# EAGLE design alu3 (EAGLE 7.6.0)
ALU

## Sheet 1 of 8: Accum Reg
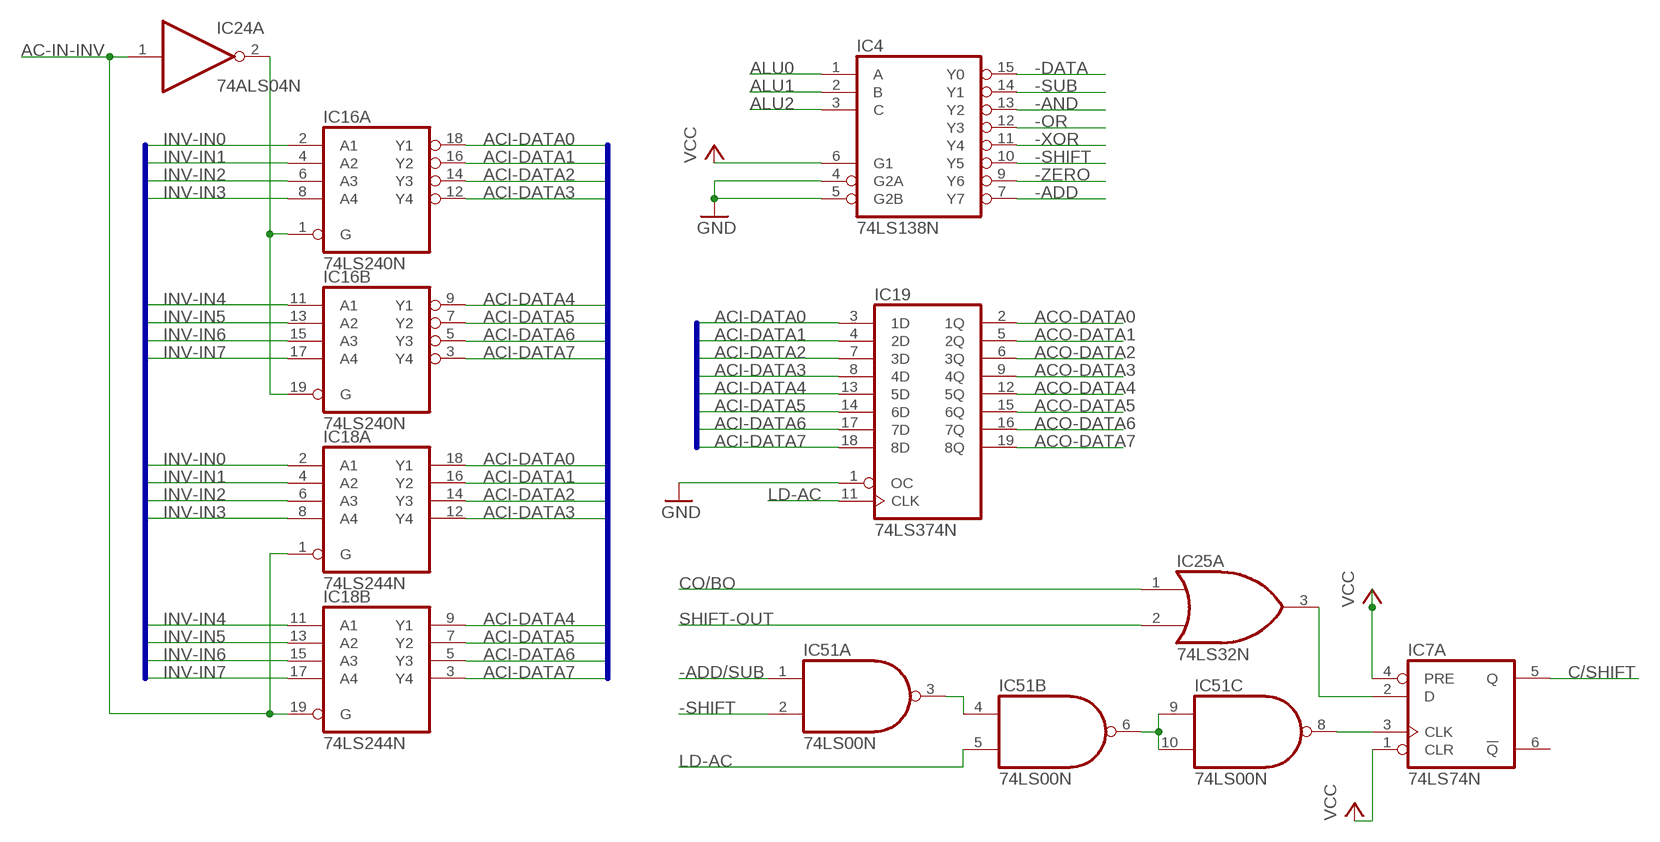
[diagram p0: schematic, sheet 1]

### Parts
IC4  74LS138N  [DIL16]
IC7  74LS74N  [DIL14]
IC16  74LS240N  [DIL20]
IC18  74LS244N  [DIL20]
IC19  74LS374N  [DIL20]
IC24  74ALS04N  [DIL14]
IC25  74LS32N  [DIL14]
IC51  74LS00N  [DIL14]

### Nets
-ADD: IC4.7(Y7) ; also sheet 8
-ADD/SUB: IC51.1(A:I0) ; also sheet 8
-AND: IC4.13(Y2) ; also sheet 5
-DATA: IC4.15(Y0) ; also sheet 4
-OR: IC4.12(Y3) ; also sheet 5
-SHIFT: IC4.10(Y5) IC51.2(A:I1) ; also sheet 7
-SUB: IC4.14(Y1) ; also sheet 8
-XOR: IC4.11(Y4) ; also sheet 5
-ZERO: IC4.9(Y6) ; also sheet 5
AC-IN-INV: IC18.1(A:G) IC18.19(B:G) IC24.1(A:I) ; also sheet 2,6
ACI-DATA0: IC16.18(A:Y1) IC18.18(A:Y1) IC19.3(1D)
ACI-DATA1: IC16.16(A:Y2) IC18.16(A:Y2) IC19.4(2D)
ACI-DATA2: IC16.14(A:Y3) IC18.14(A:Y3) IC19.7(3D)
ACI-DATA3: IC16.12(A:Y4) IC18.12(A:Y4) IC19.8(4D)
ACI-DATA4: IC16.9(B:Y1) IC18.9(B:Y1) IC19.13(5D)
ACI-DATA5: IC16.7(B:Y2) IC18.7(B:Y2) IC19.14(6D)
ACI-DATA6: IC16.5(B:Y3) IC18.5(B:Y3) IC19.17(7D)
ACI-DATA7: IC16.3(B:Y4) IC18.3(B:Y4) IC19.18(8D)
ACO-DATA0: IC19.2(1Q) ; also sheet 4,5,6,7,8
ACO-DATA1: IC19.5(2Q) ; also sheet 4,5,6,7,8
ACO-DATA2: IC19.6(3Q) ; also sheet 4,5,6,7,8
ACO-DATA3: IC19.9(4Q) ; also sheet 4,5,6,7,8
ACO-DATA4: IC19.12(5Q) ; also sheet 4,5,6,7,8
ACO-DATA5: IC19.15(6Q) ; also sheet 4,5,6,7,8
ACO-DATA6: IC19.16(7Q) ; also sheet 4,5,6,7,8
ACO-DATA7: IC19.19(8Q) ; also sheet 4,5,6,7,8
ALU0: IC4.1(A) ; also sheet 2,6,7
ALU1: IC4.2(B) ; also sheet 2,6,7
ALU2: IC4.3(C) ; also sheet 2,6,7
C/SHIFT: IC7.5(A:Q) ; also sheet 6,7,8
CO/BO: IC25.1(A:I0) ; also sheet 8
GND: IC4.4(G2A) IC4.5(G2B) IC19.1(OC) ; also sheet 2,5,6,7
INV-IN0: IC16.2(A:A1) IC18.2(A:A1) ; also sheet 4,5,7,8
INV-IN1: IC16.4(A:A2) IC18.4(A:A2) ; also sheet 4,5,7,8
INV-IN2: IC16.6(A:A3) IC18.6(A:A3) ; also sheet 4,5,7,8
INV-IN3: IC16.8(A:A4) IC18.8(A:A4) ; also sheet 4,5,7,8
INV-IN4: IC16.11(B:A1) IC18.11(B:A1) ; also sheet 4,5,7,8
INV-IN5: IC16.13(B:A2) IC18.13(B:A2) ; also sheet 4,5,7,8
INV-IN6: IC16.15(B:A3) IC18.15(B:A3) ; also sheet 4,5,7,8
INV-IN7: IC16.17(B:A4) IC18.17(B:A4) ; also sheet 4,5,7,8
LD-AC: IC19.11(CLK) IC51.5(B:I1) ; also sheet 2
N$3: IC51.3(A:O) IC51.4(B:I0)
N$4: IC51.6(B:O) IC51.9(C:I0) IC51.10(C:I1)
N$5: IC7.3(A:CLK) IC51.8(C:O)
N$7: IC7.2(A:D) IC25.3(A:O)
N$42: IC16.1(A:G) IC16.19(B:G) IC24.2(A:O)
SHIFT-OUT: IC25.2(A:I1) ; also sheet 7
VCC: IC4.6(G1) IC7.1(A:CLR) IC7.4(A:PRE) ; also sheet 2,6,7
Unconnected: IC7.6(A:!Q) IC24.5(C:I) IC24.6(C:O) IC24.10(E:O) IC24.11(E:I) IC25.4(B:I0) IC25.5(B:I1) IC25.6(B:O) IC25.11(D:O) IC25.12(D:I0) IC25.13(D:I1) IC51.11(D:O) IC51.12(D:I0) IC51.13(D:I1)

### Buses
INV-IN[0..7]
ACI-DATA[0..7]

## Sheet 2 of 8: BUS
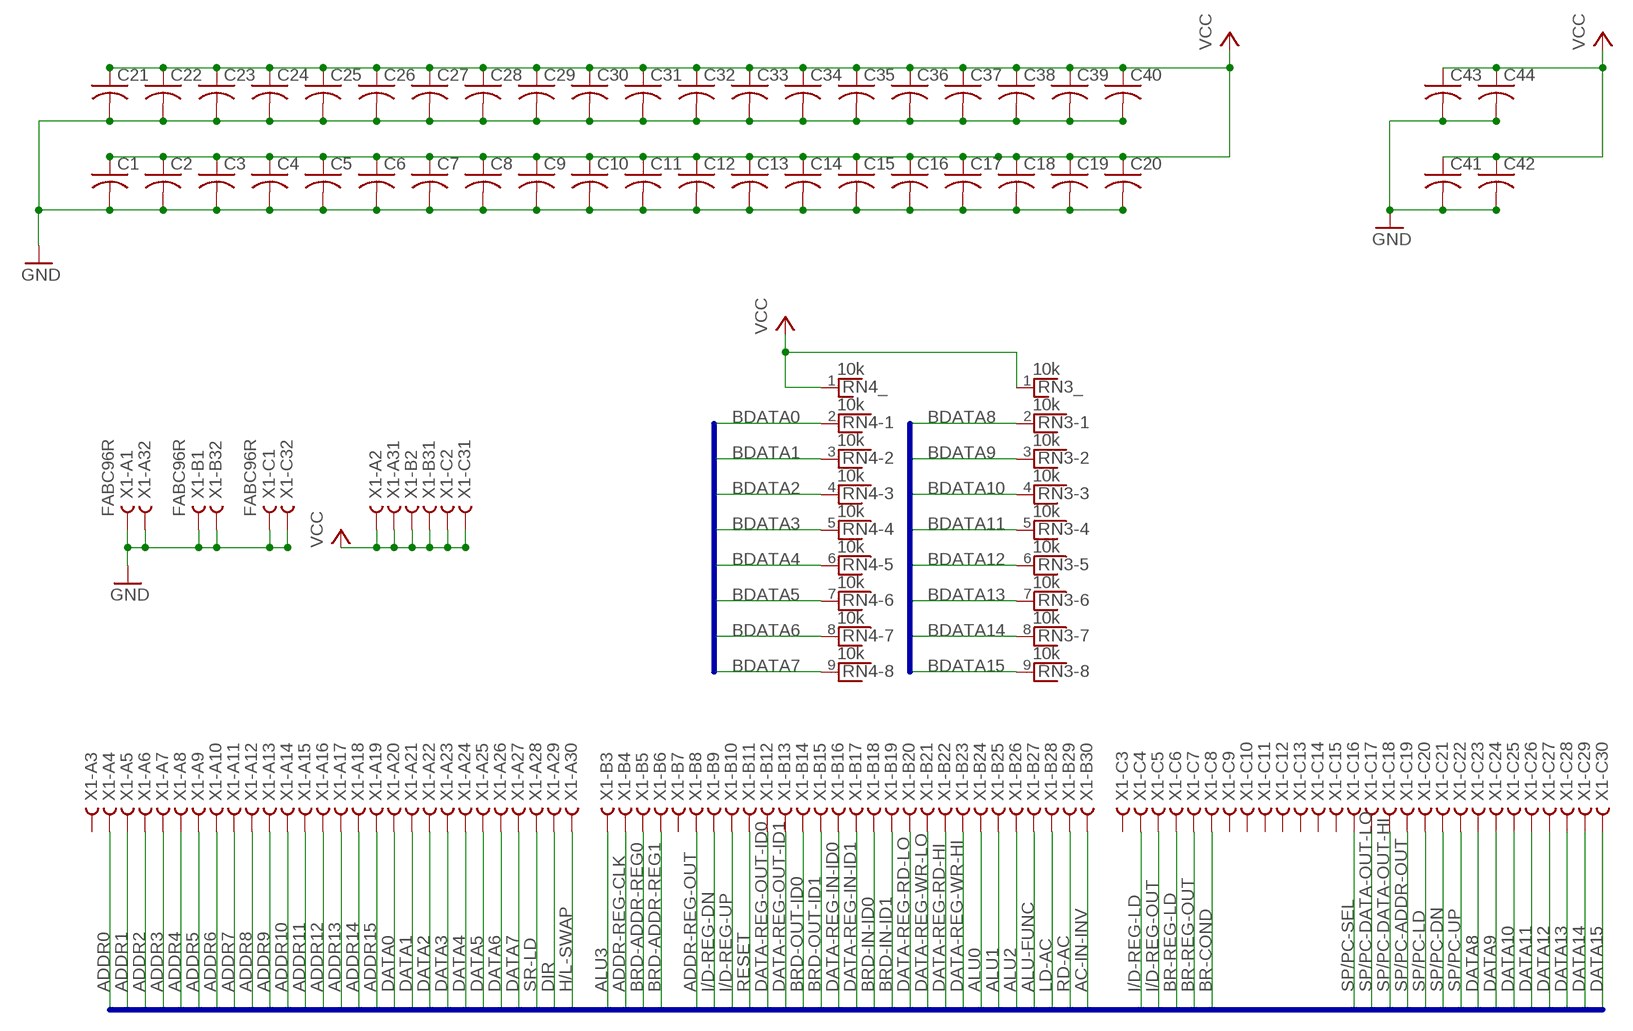
[diagram p1: schematic, sheet 2]

### Parts
C1  C-US025-024X044  [C025-024X044]
C2  C-US025-024X044  [C025-024X044]
C3  C-US025-024X044  [C025-024X044]
C4  C-US025-024X044  [C025-024X044]
C5  C-US025-024X044  [C025-024X044]
C6  C-US025-024X044  [C025-024X044]
C7  C-US025-024X044  [C025-024X044]
C8  C-US025-024X044  [C025-024X044]
C9  C-US025-024X044  [C025-024X044]
C10  C-US025-024X044  [C025-024X044]
C11  C-US025-024X044  [C025-024X044]
C12  C-US025-024X044  [C025-024X044]
C13  C-US025-024X044  [C025-024X044]
C14  C-US025-024X044  [C025-024X044]
C15  C-US025-024X044  [C025-024X044]
C16  C-US025-024X044  [C025-024X044]
C17  C-US025-024X044  [C025-024X044]
C18  C-US025-024X044  [C025-024X044]
C19  C-US025-024X044  [C025-024X044]
C20  C-US025-024X044  [C025-024X044]
C21  C-US025-024X044  [C025-024X044]
C22  C-US025-024X044  [C025-024X044]
C23  C-US025-024X044  [C025-024X044]
C24  C-US025-024X044  [C025-024X044]
C25  C-US025-024X044  [C025-024X044]
C26  C-US025-024X044  [C025-024X044]
C27  C-US025-024X044  [C025-024X044]
C28  C-US025-024X044  [C025-024X044]
C29  C-US025-024X044  [C025-024X044]
C30  C-US025-024X044  [C025-024X044]
C31  C-US025-024X044  [C025-024X044]
C32  C-US025-024X044  [C025-024X044]
C33  C-US025-024X044  [C025-024X044]
C34  C-US025-024X044  [C025-024X044]
C35  C-US025-024X044  [C025-024X044]
C36  C-US025-024X044  [C025-024X044]
C37  C-US025-024X044  [C025-024X044]
C38  C-US025-024X044  [C025-024X044]
C39  C-US025-024X044  [C025-024X044]
C40  C-US025-024X044  [C025-024X044]
C41  C-US025-024X044  [C025-024X044]
C42  C-US025-024X044  [C025-024X044]
C43  C-US025-024X044  [C025-024X044]
C44  C-US025-024X044  [C025-024X044]
RN3  10k  RNX8  [RN-9]
RN4  10k  RNX8  [RN-9]
X1  FABC96R  [FABC96R]

### Nets
AC-IN-INV: X1.B30 ; also sheet 1,6
ADDR0: X1.A4
ADDR1: X1.A5
ADDR2: X1.A6
ADDR3: X1.A7
ADDR4: X1.A8
ADDR5: X1.A9
ADDR6: X1.A10
ADDR7: X1.A11
ADDR8: X1.A12
ADDR9: X1.A13
ADDR10: X1.A14
ADDR11: X1.A15
ADDR12: X1.A16
ADDR13: X1.A17
ADDR14: X1.A18
ADDR15: X1.A19
ADDR-REG-CLK: X1.B4
ADDR-REG-OUT: X1.B8
ALU0: X1.B24 ; also sheet 1,6,7
ALU1: X1.B25 ; also sheet 1,6,7
ALU2: X1.B26 ; also sheet 1,6,7
ALU3: X1.B3 ; also sheet 7,8
ALU-FUNC: X1.B27 ; also sheet 4
BDATA0: RN4.2 ; also sheet 3,4,5,6,8
BDATA1: RN4.3 ; also sheet 3,4,5,6,8
BDATA2: RN4.4 ; also sheet 3,4,5,6,8
BDATA3: RN4.5 ; also sheet 3,4,5,6,8
BDATA4: RN4.6 ; also sheet 3,4,5,6,8
BDATA5: RN4.7 ; also sheet 3,4,5,6,8
BDATA6: RN4.8 ; also sheet 3,4,5,6,8
BDATA7: RN4.9 ; also sheet 3,4,5,6,8
BDATA8: RN3.2 ; also sheet 3,4,6
BDATA9: RN3.3 ; also sheet 3,4,6
BDATA10: RN3.4 ; also sheet 3,4,6
BDATA11: RN3.5 ; also sheet 3,4,6
BDATA12: RN3.6 ; also sheet 3,4,6
BDATA13: RN3.7 ; also sheet 3,4,6
BDATA14: RN3.8 ; also sheet 3,4,6
BDATA15: RN3.9 ; also sheet 3,4,6
BR-COND: X1.C8 ; also sheet 6
BR-REG-LD: X1.C6
BR-REG-OUT: X1.C7
BRD-ADDR-REG0: X1.B5
BRD-ADDR-REG1: X1.B6
BRD-IN-ID0: X1.B18
BRD-IN-ID1: X1.B19
BRD-OUT-ID0: X1.B14
BRD-OUT-ID1: X1.B15
DATA0: X1.A20 ; also sheet 4
DATA1: X1.A21 ; also sheet 4
DATA2: X1.A22 ; also sheet 4
DATA3: X1.A23 ; also sheet 4
DATA4: X1.A24 ; also sheet 4
DATA5: X1.A25 ; also sheet 4
DATA6: X1.A26 ; also sheet 4
DATA7: X1.A27 ; also sheet 4
DATA8: X1.C23 ; also sheet 4
DATA9: X1.C24 ; also sheet 4
DATA10: X1.C25 ; also sheet 4
DATA11: X1.C26 ; also sheet 4
DATA12: X1.C27 ; also sheet 4
DATA13: X1.C28 ; also sheet 4
DATA14: X1.C29 ; also sheet 4
DATA15: X1.C30 ; also sheet 4
DATA-REG-IN-ID0: X1.B16
DATA-REG-IN-ID1: X1.B17
DATA-REG-OUT-ID0: X1.B12
DATA-REG-OUT-ID1: X1.B13
DATA-REG-RD-HI: X1.B22
DATA-REG-RD-LO: X1.B20
DATA-REG-WR-HI: X1.B23
DATA-REG-WR-LO: X1.B21
DIR: X1.A29
GND: C1.2 C2.2 C3.2 C4.2 C5.2 C6.2 C7.2 C8.2 C9.2 C10.2 C11.2 C12.2 C13.2 C14.2 C15.2 C16.2 C17.2 C18.2 C19.2 C20.2 C21.2 C22.2 C23.2 C24.2 C25.2 C26.2 C27.2 C28.2 C29.2 C30.2 C31.2 C32.2 C33.2 C34.2 C35.2 C36.2 C37.2 C38.2 C39.2 C40.2 C41.2 C42.2 C43.2 C44.2 X1.A1 X1.A32 X1.B1 X1.B32 X1.C1 X1.C32 ; also sheet 1,5,6,7
H/L-SWAP: X1.A30
I/D-REG-DN: X1.B9 ; also sheet 3
I/D-REG-LD: X1.C4 ; also sheet 3
I/D-REG-OUT: X1.C5 ; also sheet 3,4
I/D-REG-UP: X1.B10 ; also sheet 3
LD-AC: X1.B28 ; also sheet 1
RD-AC: X1.B29 ; also sheet 4
RESET: X1.B11 ; also sheet 3
SP/PC-ADDR-OUT: X1.C19
SP/PC-DATA-OUT-HI: X1.C18
SP/PC-DATA-OUT-LO: X1.C17
SP/PC-DN: X1.C21
SP/PC-LD: X1.C20
SP/PC-SEL: X1.C16
SP/PC-UP: X1.C22
SR-LD: X1.A28 ; also sheet 7
VCC: C1.1 C2.1 C3.1 C4.1 C5.1 C6.1 C7.1 C8.1 C9.1 C10.1 C11.1 C12.1 C13.1 C14.1 C15.1 C16.1 C17.1 C18.1 C19.1 C20.1 C21.1 C22.1 C23.1 C24.1 C25.1 C26.1 C27.1 C28.1 C29.1 C30.1 C31.1 C32.1 C33.1 C34.1 C35.1 C36.1 C37.1 C38.1 C39.1 C40.1 C41.1 C42.1 C43.1 C44.1 RN3.1 RN4.1 X1.A2 X1.A31 X1.B2 X1.B31 X1.C2 X1.C31 ; also sheet 1,6,7
Unconnected: X1.A3 X1.B7 X1.C3 X1.C9 X1.C10 X1.C11 X1.C12 X1.C13 X1.C14 X1.C15

### Buses
ADDR[0..15],DATA[0..15],DIR,H/L-SWAP,ADDR-REG-CLK,BRD-ADDR-REG[0..1],ADDR-REG-OUT,I/D-REG-DN,I/D-REG-UP,RESET,DATA-REG-OUT-ID[0..1],BRD-OUT-ID[0..1],DATA-REG-IN-ID[0..1],BRD-IN-ID[0..1],DATA-REG-RD-LO,DATA-REG-WR-LO,DATA-REG-RD-HI,DATA-REG-WR-HI,ALU[0..3],ALU-FUNC,LD-AC,RD-AC,AC-IN-INV,I/D-REG-LD,I/D-REG-OUT,BR-REG-LD,BR-REG-OUT,BR-COND,SP/PC-SEL,SP/PC-DATA-OUT-LO,SP/PC-DATA-OUT-HI,SP/PC-ADDR-OUT,SP/PC-LD,SP/PC-DN,SP/PC-UP,SR-LD
BDATA[0..15]

## Sheet 3 of 8: Reg INC/DEC
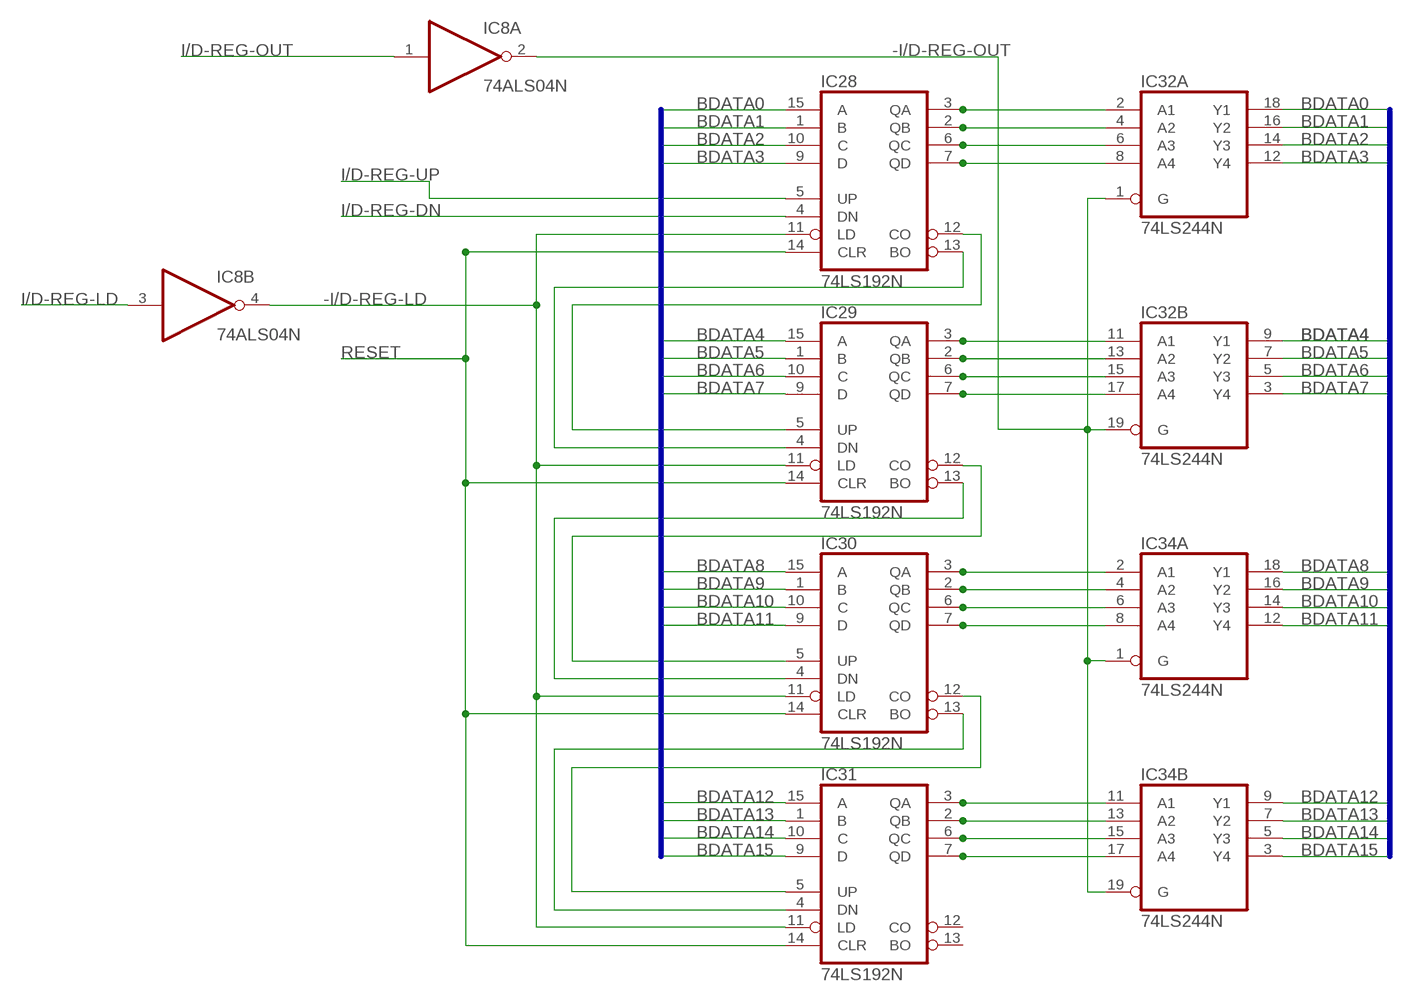
[diagram p2: schematic, sheet 3]

### Parts
IC8  74ALS04N  [DIL14]
IC28  74LS192N  [DIL16]
IC29  74LS192N  [DIL16]
IC30  74LS192N  [DIL16]
IC31  74LS192N  [DIL16]
IC32  74LS244N  [DIL20]
IC34  74LS244N  [DIL20]

### Nets
-I/D-REG-LD: IC8.4(B:O) IC28.11(LD) IC29.11(LD) IC30.11(LD) IC31.11(LD)
-I/D-REG-OUT: IC8.2(A:O) IC32.1(A:G) IC32.19(B:G) IC34.1(A:G) IC34.19(B:G)
BDATA0: IC28.15(A) IC32.18(A:Y1) ; also sheet 2,4,5,6,8
BDATA1: IC28.1(B) IC32.16(A:Y2) ; also sheet 2,4,5,6,8
BDATA2: IC28.10(C) IC32.14(A:Y3) ; also sheet 2,4,5,6,8
BDATA3: IC28.9(D) IC32.12(A:Y4) ; also sheet 2,4,5,6,8
BDATA4: IC29.15(A) IC32.9(B:Y1) ; also sheet 2,4,5,6,8
BDATA5: IC29.1(B) IC32.7(B:Y2) ; also sheet 2,4,5,6,8
BDATA6: IC29.10(C) IC32.5(B:Y3) ; also sheet 2,4,5,6,8
BDATA7: IC29.9(D) IC32.3(B:Y4) ; also sheet 2,4,5,6,8
BDATA8: IC30.15(A) IC34.18(A:Y1) ; also sheet 2,4,6
BDATA9: IC30.1(B) IC34.16(A:Y2) ; also sheet 2,4,6
BDATA10: IC30.10(C) IC34.14(A:Y3) ; also sheet 2,4,6
BDATA11: IC30.9(D) IC34.12(A:Y4) ; also sheet 2,4,6
BDATA12: IC31.15(A) IC34.9(B:Y1) ; also sheet 2,4,6
BDATA13: IC31.1(B) IC34.7(B:Y2) ; also sheet 2,4,6
BDATA14: IC31.10(C) IC34.5(B:Y3) ; also sheet 2,4,6
BDATA15: IC31.9(D) IC34.3(B:Y4) ; also sheet 2,4,6
I/D-REG-DN: IC28.4(DN) ; also sheet 2
I/D-REG-LD: IC8.3(B:I) ; also sheet 2
I/D-REG-OUT: IC8.1(A:I) ; also sheet 2,4
I/D-REG-UP: IC28.5(UP) ; also sheet 2
N$58: IC28.13(BO) IC29.4(DN)
N$59: IC28.12(CO) IC29.5(UP)
N$60: IC29.13(BO) IC30.4(DN)
N$61: IC29.12(CO) IC30.5(UP)
N$62: IC30.13(BO) IC31.4(DN)
N$63: IC30.12(CO) IC31.5(UP)
R1D0: IC28.7(QD) IC32.8(A:A4)
R1D1: IC28.6(QC) IC32.6(A:A3)
R1D2: IC28.2(QB) IC32.4(A:A2)
R1D3: IC28.3(QA) IC32.2(A:A1)
R1D4: IC29.7(QD) IC32.17(B:A4)
R1D5: IC29.6(QC) IC32.15(B:A3)
R1D6: IC29.2(QB) IC32.13(B:A2)
R1D7: IC29.3(QA) IC32.11(B:A1)
R1D8: IC30.7(QD) IC34.8(A:A4)
R1D9: IC30.6(QC) IC34.6(A:A3)
R1D10: IC30.2(QB) IC34.4(A:A2)
R1D11: IC30.3(QA) IC34.2(A:A1)
R1D12: IC31.7(QD) IC34.17(B:A4)
R1D13A: IC31.6(QC) IC34.15(B:A3)
R1D14: IC31.2(QB) IC34.13(B:A2)
R1D15: IC31.3(QA) IC34.11(B:A1)
RESET: IC28.14(CLR) IC29.14(CLR) IC30.14(CLR) IC31.14(CLR) ; also sheet 2
Unconnected: IC8.5(C:I) IC8.6(C:O) IC8.8(D:O) IC8.9(D:I) IC8.10(E:O) IC8.11(E:I) IC8.12(F:O) IC8.13(F:I) IC31.12(CO) IC31.13(BO)

### Buses
BDATA[0..15]

## Sheet 4 of 8: Bus Buffering
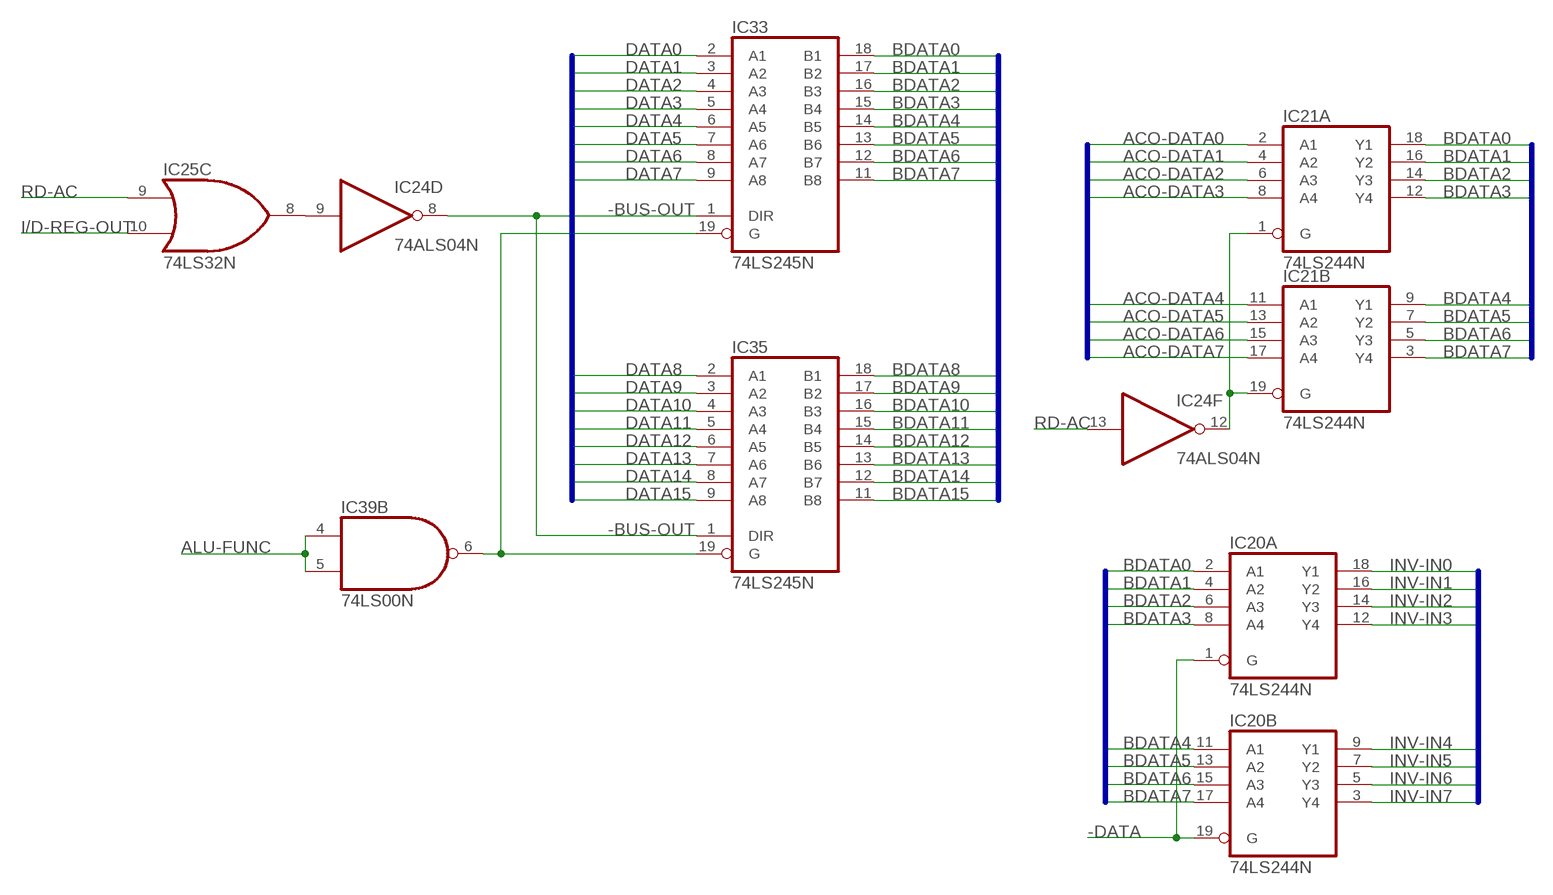
[diagram p3: schematic, sheet 4]

### Parts
IC20  74LS244N  [DIL20]
IC21  74LS244N  [DIL20]
IC33  74LS245N  [DIL20]
IC35  74LS245N  [DIL20]
IC39  74LS00N  [DIL14]

### Nets
-BUS-OUT: IC24.8(D:O) IC33.1(DIR) IC35.1(DIR)
-DATA: IC20.1(A:G) IC20.19(B:G) ; also sheet 1
-RD-AC: IC21.1(A:G) IC21.19(B:G) IC24.12(F:O)
ACO-DATA0: IC21.2(A:A1) ; also sheet 1,5,6,7,8
ACO-DATA1: IC21.4(A:A2) ; also sheet 1,5,6,7,8
ACO-DATA2: IC21.6(A:A3) ; also sheet 1,5,6,7,8
ACO-DATA3: IC21.8(A:A4) ; also sheet 1,5,6,7,8
ACO-DATA4: IC21.11(B:A1) ; also sheet 1,5,6,7,8
ACO-DATA5: IC21.13(B:A2) ; also sheet 1,5,6,7,8
ACO-DATA6: IC21.15(B:A3) ; also sheet 1,5,6,7,8
ACO-DATA7: IC21.17(B:A4) ; also sheet 1,5,6,7,8
ALU-FUNC: IC39.4(B:I0) IC39.5(B:I1) ; also sheet 2
BDATA0: IC20.2(A:A1) IC21.18(A:Y1) IC33.18(B1) ; also sheet 2,3,5,6,8
BDATA1: IC20.4(A:A2) IC21.16(A:Y2) IC33.17(B2) ; also sheet 2,3,5,6,8
BDATA2: IC20.6(A:A3) IC21.14(A:Y3) IC33.16(B3) ; also sheet 2,3,5,6,8
BDATA3: IC20.8(A:A4) IC21.12(A:Y4) IC33.15(B4) ; also sheet 2,3,5,6,8
BDATA4: IC20.11(B:A1) IC21.9(B:Y1) IC33.14(B5) ; also sheet 2,3,5,6,8
BDATA5: IC20.13(B:A2) IC21.7(B:Y2) IC33.13(B6) ; also sheet 2,3,5,6,8
BDATA6: IC20.15(B:A3) IC21.5(B:Y3) IC33.12(B7) ; also sheet 2,3,5,6,8
BDATA7: IC20.17(B:A4) IC21.3(B:Y4) IC33.11(B8) ; also sheet 2,3,5,6,8
BDATA8: IC35.18(B1) ; also sheet 2,3,6
BDATA9: IC35.17(B2) ; also sheet 2,3,6
BDATA10: IC35.16(B3) ; also sheet 2,3,6
BDATA11: IC35.15(B4) ; also sheet 2,3,6
BDATA12: IC35.14(B5) ; also sheet 2,3,6
BDATA13: IC35.13(B6) ; also sheet 2,3,6
BDATA14: IC35.12(B7) ; also sheet 2,3,6
BDATA15: IC35.11(B8) ; also sheet 2,3,6
DATA0: IC33.2(A1) ; also sheet 2
DATA1: IC33.3(A2) ; also sheet 2
DATA2: IC33.4(A3) ; also sheet 2
DATA3: IC33.5(A4) ; also sheet 2
DATA4: IC33.6(A5) ; also sheet 2
DATA5: IC33.7(A6) ; also sheet 2
DATA6: IC33.8(A7) ; also sheet 2
DATA7: IC33.9(A8) ; also sheet 2
DATA8: IC35.2(A1) ; also sheet 2
DATA9: IC35.3(A2) ; also sheet 2
DATA10: IC35.4(A3) ; also sheet 2
DATA11: IC35.5(A4) ; also sheet 2
DATA12: IC35.6(A5) ; also sheet 2
DATA13: IC35.7(A6) ; also sheet 2
DATA14: IC35.8(A7) ; also sheet 2
DATA15: IC35.9(A8) ; also sheet 2
I/D-REG-OUT: IC25.10(C:I1) ; also sheet 2,3
INV-IN0: IC20.18(A:Y1) ; also sheet 1,5,7,8
INV-IN1: IC20.16(A:Y2) ; also sheet 1,5,7,8
INV-IN2: IC20.14(A:Y3) ; also sheet 1,5,7,8
INV-IN3: IC20.12(A:Y4) ; also sheet 1,5,7,8
INV-IN4: IC20.9(B:Y1) ; also sheet 1,5,7,8
INV-IN5: IC20.7(B:Y2) ; also sheet 1,5,7,8
INV-IN6: IC20.5(B:Y3) ; also sheet 1,5,7,8
INV-IN7: IC20.3(B:Y4) ; also sheet 1,5,7,8
N$9: IC24.9(D:I) IC25.8(C:O)
N$64: IC33.19(G) IC35.19(G) IC39.6(B:O)
RD-AC: IC24.13(F:I) IC25.9(C:I0) ; also sheet 2
Unconnected: IC39.1(A:I0) IC39.2(A:I1) IC39.3(A:O) IC39.8(C:O) IC39.9(C:I0) IC39.10(C:I1) IC39.11(D:O) IC39.12(D:I0) IC39.13(D:I1)

### Buses
BDATA[0..15]
DATA[0..15]
INV-IN[0..7]
BDATA[0..7]
ACO-DATA[0..7]

## Sheet 5 of 8: Logical
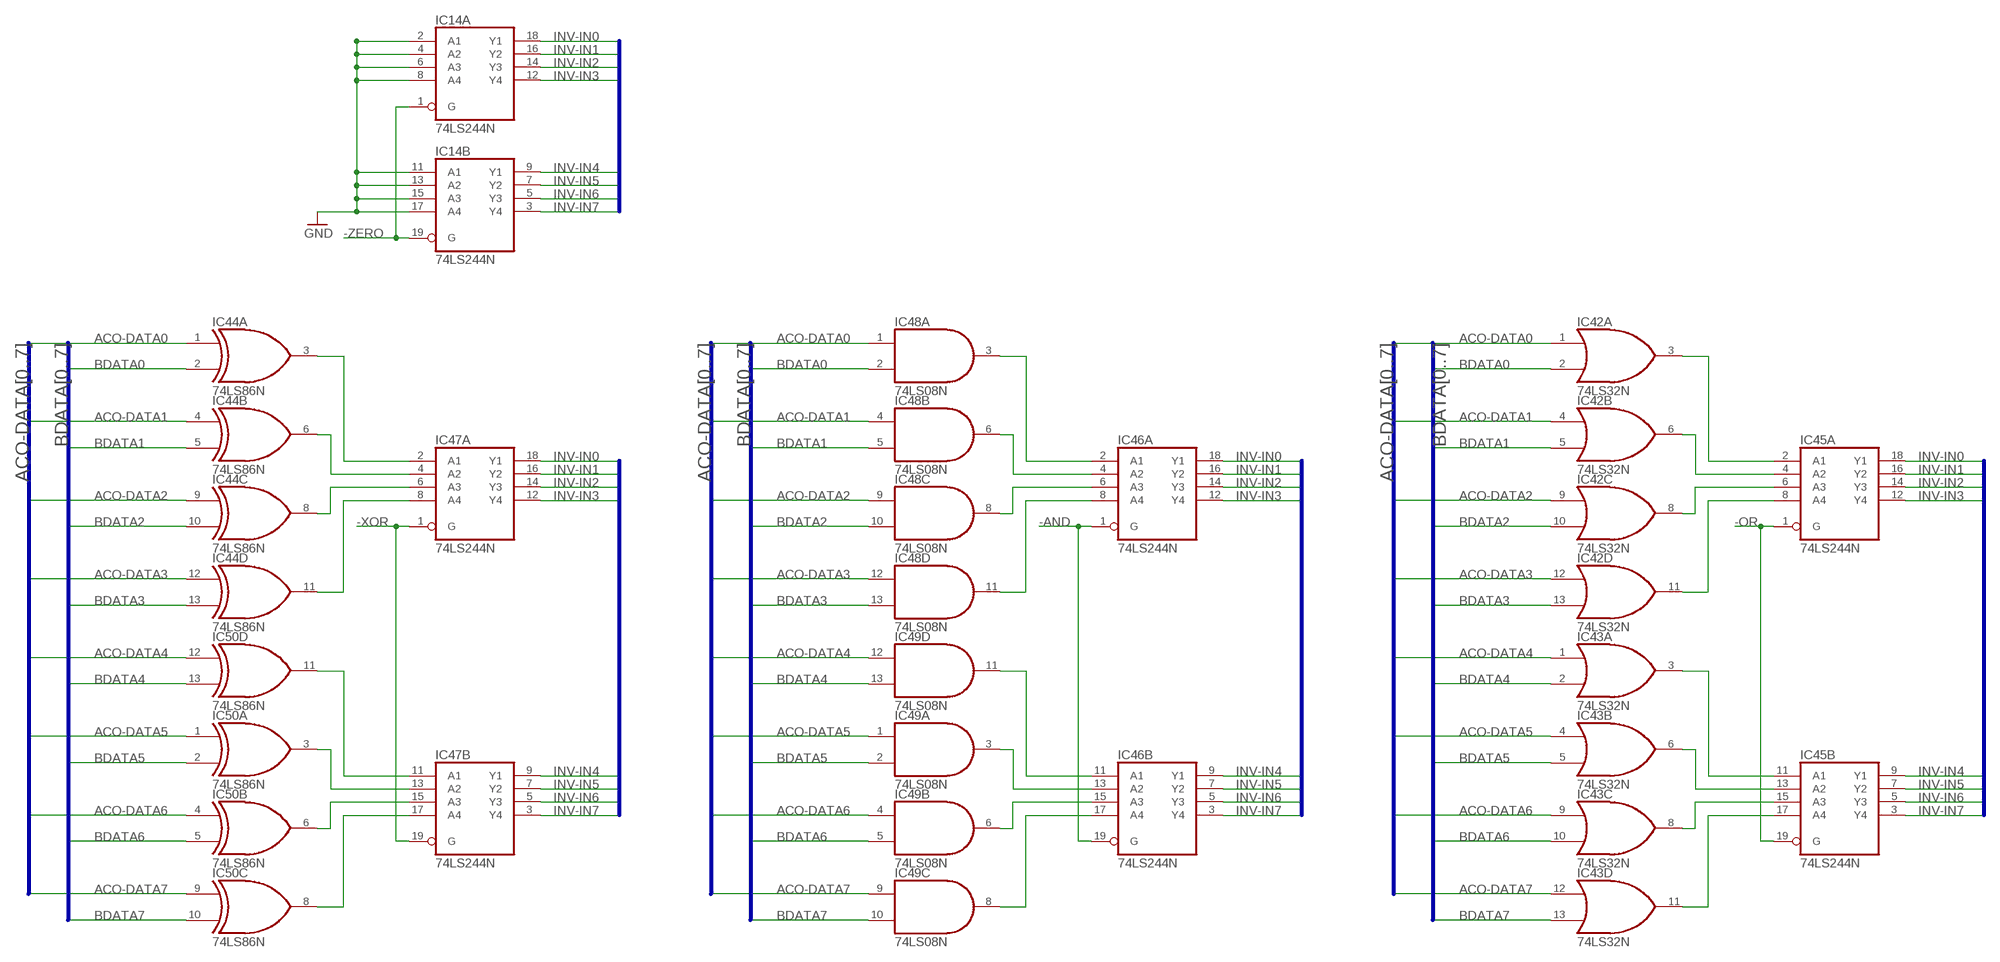
[diagram p4: schematic, sheet 5]

### Parts
IC14  74LS244N  [DIL20]
IC42  74LS32N  [DIL14]
IC43  74LS32N  [DIL14]
IC44  74LS86N  [DIL14]
IC45  74LS244N  [DIL20]
IC46  74LS244N  [DIL20]
IC47  74LS244N  [DIL20]
IC48  74LS08N  [DIL14]
IC49  74LS08N  [DIL14]
IC50  74LS86N  [DIL14]

### Nets
-AND: IC46.1(A:G) IC46.19(B:G) ; also sheet 1
-OR: IC45.1(A:G) IC45.19(B:G) ; also sheet 1
-XOR: IC47.1(A:G) IC47.19(B:G) ; also sheet 1
-ZERO: IC14.1(A:G) IC14.19(B:G) ; also sheet 1
ACO-DATA0: IC42.1(A:I0) IC44.1(A:I0) IC48.1(A:I0) ; also sheet 1,4,6,7,8
ACO-DATA1: IC42.4(B:I0) IC44.4(B:I0) IC48.4(B:I0) ; also sheet 1,4,6,7,8
ACO-DATA2: IC42.9(C:I0) IC44.9(C:I0) IC48.9(C:I0) ; also sheet 1,4,6,7,8
ACO-DATA3: IC42.12(D:I0) IC44.12(D:I0) IC48.12(D:I0) ; also sheet 1,4,6,7,8
ACO-DATA4: IC43.1(A:I0) IC49.12(D:I0) IC50.12(D:I0) ; also sheet 1,4,6,7,8
ACO-DATA5: IC43.4(B:I0) IC49.1(A:I0) IC50.1(A:I0) ; also sheet 1,4,6,7,8
ACO-DATA6: IC43.9(C:I0) IC49.4(B:I0) IC50.4(B:I0) ; also sheet 1,4,6,7,8
ACO-DATA7: IC43.12(D:I0) IC49.9(C:I0) IC50.9(C:I0) ; also sheet 1,4,6,7,8
BDATA0: IC42.2(A:I1) IC44.2(A:I1) IC48.2(A:I1) ; also sheet 2,3,4,6,8
BDATA1: IC42.5(B:I1) IC44.5(B:I1) IC48.5(B:I1) ; also sheet 2,3,4,6,8
BDATA2: IC42.10(C:I1) IC44.10(C:I1) IC48.10(C:I1) ; also sheet 2,3,4,6,8
BDATA3: IC42.13(D:I1) IC44.13(D:I1) IC48.13(D:I1) ; also sheet 2,3,4,6,8
BDATA4: IC43.2(A:I1) IC49.13(D:I1) IC50.13(D:I1) ; also sheet 2,3,4,6,8
BDATA5: IC43.5(B:I1) IC49.2(A:I1) IC50.2(A:I1) ; also sheet 2,3,4,6,8
BDATA6: IC43.10(C:I1) IC49.5(B:I1) IC50.5(B:I1) ; also sheet 2,3,4,6,8
BDATA7: IC43.13(D:I1) IC49.10(C:I1) IC50.10(C:I1) ; also sheet 2,3,4,6,8
GND: IC14.2(A:A1) IC14.4(A:A2) IC14.6(A:A3) IC14.8(A:A4) IC14.11(B:A1) IC14.13(B:A2) IC14.15(B:A3) IC14.17(B:A4) ; also sheet 1,2,6,7
INV-IN0: IC14.18(A:Y1) IC45.18(A:Y1) IC46.18(A:Y1) IC47.18(A:Y1) ; also sheet 1,4,7,8
INV-IN1: IC14.16(A:Y2) IC45.16(A:Y2) IC46.16(A:Y2) IC47.16(A:Y2) ; also sheet 1,4,7,8
INV-IN2: IC14.14(A:Y3) IC45.14(A:Y3) IC46.14(A:Y3) IC47.14(A:Y3) ; also sheet 1,4,7,8
INV-IN3: IC14.12(A:Y4) IC45.12(A:Y4) IC46.12(A:Y4) IC47.12(A:Y4) ; also sheet 1,4,7,8
INV-IN4: IC14.9(B:Y1) IC45.9(B:Y1) IC46.9(B:Y1) IC47.9(B:Y1) ; also sheet 1,4,7,8
INV-IN5: IC14.7(B:Y2) IC45.7(B:Y2) IC46.7(B:Y2) IC47.7(B:Y2) ; also sheet 1,4,7,8
INV-IN6: IC14.5(B:Y3) IC45.5(B:Y3) IC46.5(B:Y3) IC47.5(B:Y3) ; also sheet 1,4,7,8
INV-IN7: IC14.3(B:Y4) IC45.3(B:Y4) IC46.3(B:Y4) IC47.3(B:Y4) ; also sheet 1,4,7,8
N$77: IC42.3(A:O) IC45.2(A:A1)
N$78: IC42.6(B:O) IC45.4(A:A2)
N$79: IC42.8(C:O) IC45.6(A:A3)
N$81: IC42.11(D:O) IC45.8(A:A4)
N$82: IC43.3(A:O) IC45.11(B:A1)
N$83: IC43.6(B:O) IC45.13(B:A2)
N$84: IC43.8(C:O) IC45.15(B:A3)
N$85: IC43.11(D:O) IC45.17(B:A4)
N$86: IC46.2(A:A1) IC48.3(A:O)
N$87: IC46.4(A:A2) IC48.6(B:O)
N$88: IC46.6(A:A3) IC48.8(C:O)
N$89: IC46.8(A:A4) IC48.11(D:O)
N$90: IC46.11(B:A1) IC49.11(D:O)
N$91: IC46.13(B:A2) IC49.3(A:O)
N$92: IC46.15(B:A3) IC49.6(B:O)
N$93: IC46.17(B:A4) IC49.8(C:O)
N$94: IC44.3(A:O) IC47.2(A:A1)
N$95: IC44.6(B:O) IC47.4(A:A2)
N$96: IC44.8(C:O) IC47.6(A:A3)
N$97: IC44.11(D:O) IC47.8(A:A4)
N$98: IC47.11(B:A1) IC50.11(D:O)
N$99: IC47.13(B:A2) IC50.3(A:O)
N$100: IC47.15(B:A3) IC50.6(B:O)
N$101: IC47.17(B:A4) IC50.8(C:O)

### Buses
INV-IN[0..7]
ACO-DATA[0..7]
BDATA[0..7]

## Sheet 6 of 8: Compare
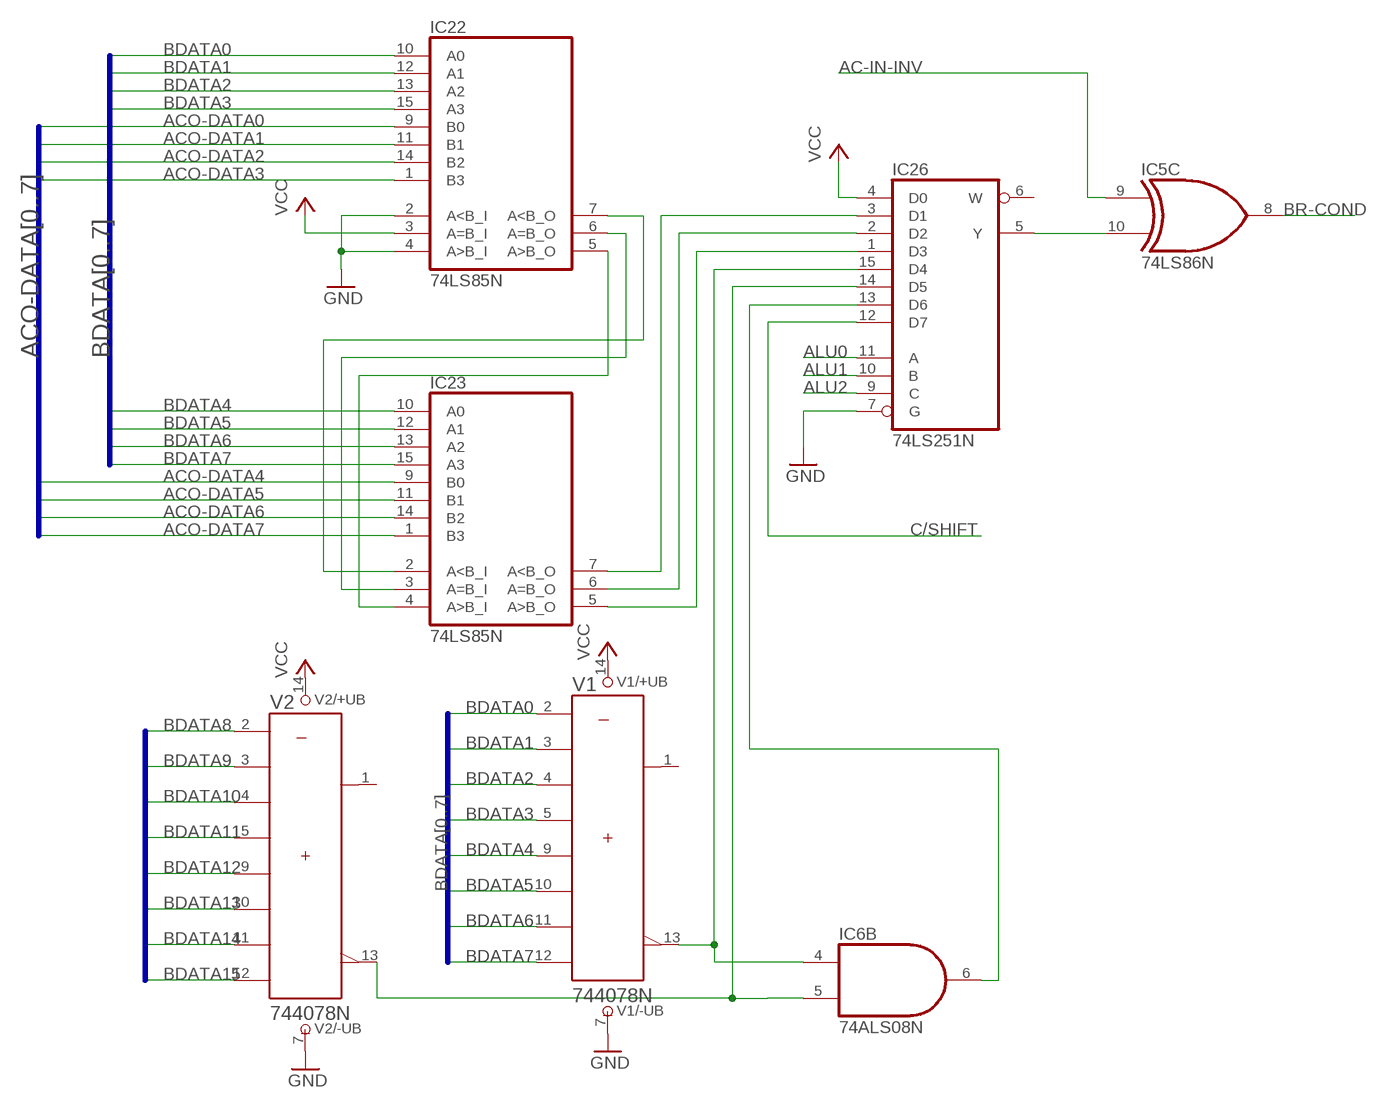
[diagram p5: schematic, sheet 6]

### Parts
IC5  74LS86N  [DIL14]
IC6  74ALS08N  [DIL14]
IC22  74LS85N  [DIL16]
IC23  74LS85N  [DIL16]
IC26  74LS251N  [DIL16]
V1  744078N  [DIL14]
V2  744078N  [DIL14]

### Nets
AC-IN-INV: IC5.9(C:I0) ; also sheet 1,2
ACO-DATA0: IC22.9(B0) ; also sheet 1,4,5,7,8
ACO-DATA1: IC22.11(B1) ; also sheet 1,4,5,7,8
ACO-DATA2: IC22.14(B2) ; also sheet 1,4,5,7,8
ACO-DATA3: IC22.1(B3) ; also sheet 1,4,5,7,8
ACO-DATA4: IC23.9(B0) ; also sheet 1,4,5,7,8
ACO-DATA5: IC23.11(B1) ; also sheet 1,4,5,7,8
ACO-DATA6: IC23.14(B2) ; also sheet 1,4,5,7,8
ACO-DATA7: IC23.1(B3) ; also sheet 1,4,5,7,8
ALU0: IC26.11(A) ; also sheet 1,2,7
ALU1: IC26.10(B) ; also sheet 1,2,7
ALU2: IC26.9(C) ; also sheet 1,2,7
BDATA0: IC22.10(A0) V1.2(A) ; also sheet 2,3,4,5,8
BDATA1: IC22.12(A1) V1.3(B) ; also sheet 2,3,4,5,8
BDATA2: IC22.13(A2) V1.4(C) ; also sheet 2,3,4,5,8
BDATA3: IC22.15(A3) V1.5(D) ; also sheet 2,3,4,5,8
BDATA4: IC23.10(A0) V1.9(E) ; also sheet 2,3,4,5,8
BDATA5: IC23.12(A1) V1.10(F) ; also sheet 2,3,4,5,8
BDATA6: IC23.13(A2) V1.11(G) ; also sheet 2,3,4,5,8
BDATA7: IC23.15(A3) V1.12(H) ; also sheet 2,3,4,5,8
BDATA8: V2.2(A) ; also sheet 2,3,4
BDATA9: V2.3(B) ; also sheet 2,3,4
BDATA10: V2.4(C) ; also sheet 2,3,4
BDATA11: V2.5(D) ; also sheet 2,3,4
BDATA12: V2.9(E) ; also sheet 2,3,4
BDATA13: V2.10(F) ; also sheet 2,3,4
BDATA14: V2.11(G) ; also sheet 2,3,4
BDATA15: V2.12(H) ; also sheet 2,3,4
BR-COND: IC5.8(C:O) ; also sheet 2
C/SHIFT: IC26.12(D7) ; also sheet 1,7,8
GND: IC22.2(A<B_I) IC22.4(A>B_I) IC26.7(G) V1.7(-UB) V2.7(-UB) ; also sheet 1,2,5,7
N$6: IC6.4(B:I0) IC26.15(D4) V1.13(W)
N$43: IC22.5(A>B_O) IC23.4(A>B_I)
N$45: IC22.6(A=B_O) IC23.3(A=B_I)
N$46: IC22.7(A<B_O) IC23.2(A<B_I)
N$47: IC23.7(A<B_O) IC26.3(D1)
N$48: IC23.6(A=B_O) IC26.2(D2)
N$49: IC23.5(A>B_O) IC26.1(D3)
N$52: IC6.5(B:I1) IC26.14(D5) V2.13(W)
N$55: IC6.6(B:O) IC26.13(D6)
N$56: IC5.10(C:I1) IC26.5(Y)
VCC: IC22.3(A=B_I) IC26.4(D0) V1.14(+UB) V2.14(+UB) ; also sheet 1,2,7
Unconnected: IC5.11(D:O) IC5.12(D:I0) IC5.13(D:I1) IC6.8(C:O) IC6.9(C:I0) IC6.10(C:I1) IC26.6(W) V1.1(Y) V2.1(Y)

### Buses
ACO-DATA[0..7]
BDATA[0..7]
BDATA[8..15]

## Sheet 7 of 8: Shifter
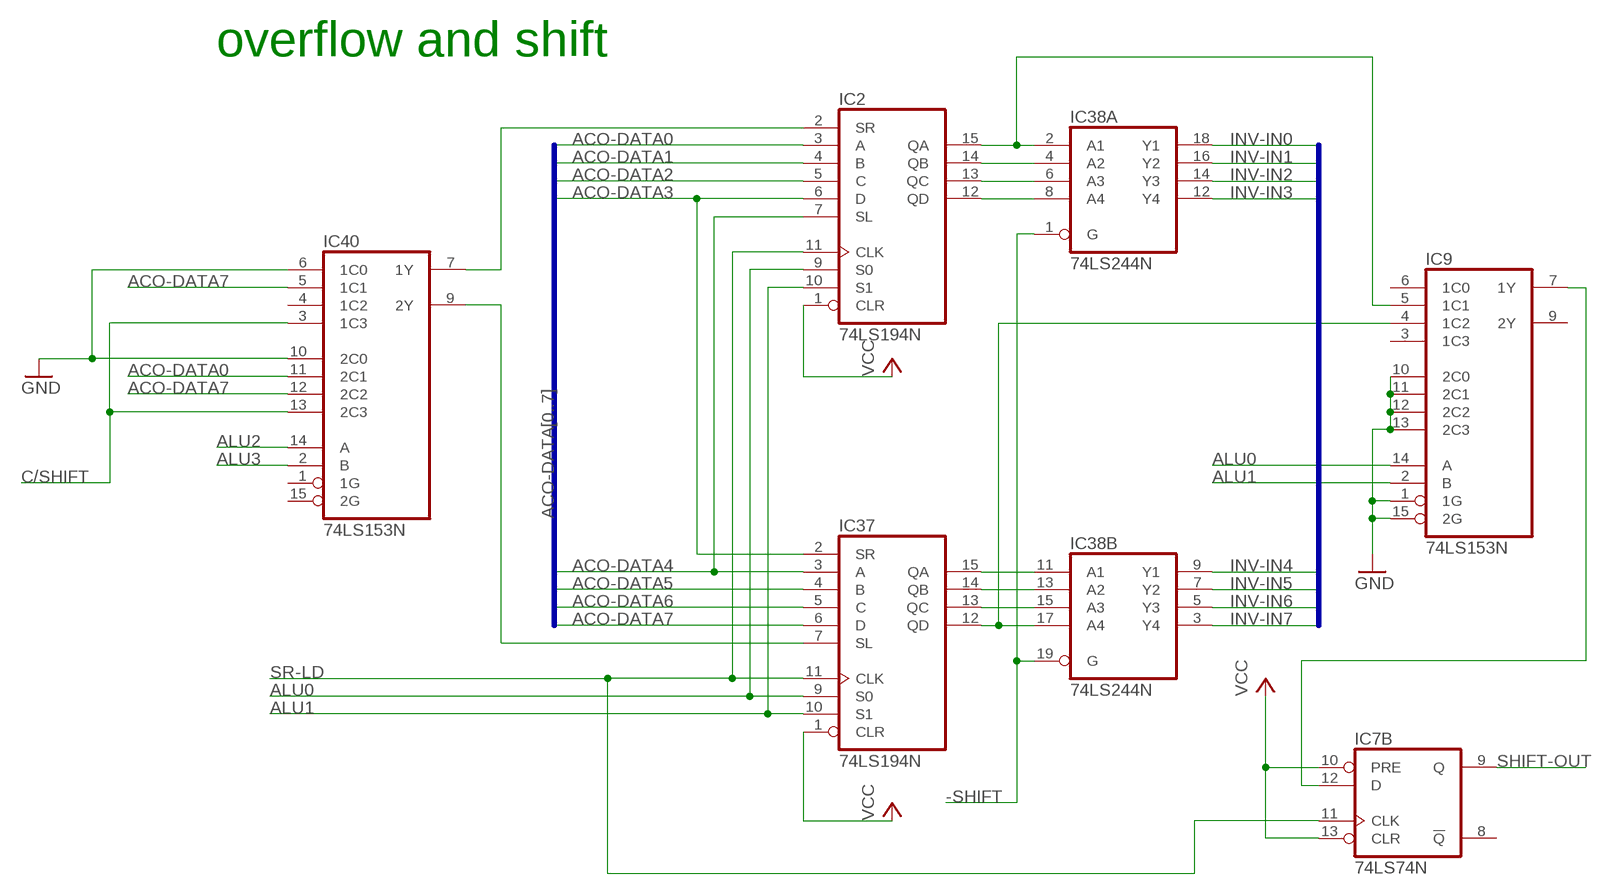
[diagram p6: schematic, sheet 7]

### Parts
IC2  74LS194N  [DIL16]
IC9  74LS153N  [DIL16]
IC37  74LS194N  [DIL16]
IC38  74LS244N  [DIL20]
IC40  74LS153N  [DIL16]

### Nets
-SHIFT: IC38.1(A:G) IC38.19(B:G) ; also sheet 1
ACO-DATA0: IC2.3(A) IC40.11(2C1) ; also sheet 1,4,5,6,8
ACO-DATA1: IC2.4(B) ; also sheet 1,4,5,6,8
ACO-DATA2: IC2.5(C) ; also sheet 1,4,5,6,8
ACO-DATA3: IC2.6(D) IC37.2(SR) ; also sheet 1,4,5,6,8
ACO-DATA4: IC2.7(SL) IC37.3(A) ; also sheet 1,4,5,6,8
ACO-DATA5: IC37.4(B) ; also sheet 1,4,5,6,8
ACO-DATA6: IC37.5(C) ; also sheet 1,4,5,6,8
ACO-DATA7: IC37.6(D) IC40.5(1C1) IC40.12(2C2) ; also sheet 1,4,5,6,8
ALU0: IC2.9(S0) IC9.14(A) IC37.9(S0) ; also sheet 1,2,6
ALU1: IC2.10(S1) IC9.2(B) IC37.10(S1) ; also sheet 1,2,6
ALU2: IC40.14(A) ; also sheet 1,2,6
ALU3: IC40.2(B) ; also sheet 2,8
C/SHIFT: IC40.3(1C3) IC40.13(2C3) ; also sheet 1,6,8
GND: IC9.1(1G) IC9.10(2C0) IC9.11(2C1) IC9.12(2C2) IC9.13(2C3) IC9.15(2G) IC40.6(1C0) IC40.10(2C0) ; also sheet 1,2,5,6
INV-IN0: IC38.18(A:Y1) ; also sheet 1,4,5,8
INV-IN1: IC38.16(A:Y2) ; also sheet 1,4,5,8
INV-IN2: IC38.14(A:Y3) ; also sheet 1,4,5,8
INV-IN3: IC38.12(A:Y4) ; also sheet 1,4,5,8
INV-IN4: IC38.9(B:Y1) ; also sheet 1,4,5,8
INV-IN5: IC38.7(B:Y2) ; also sheet 1,4,5,8
INV-IN6: IC38.5(B:Y3) ; also sheet 1,4,5,8
INV-IN7: IC38.3(B:Y4) ; also sheet 1,4,5,8
N$11: IC7.12(B:D) IC9.7(1Y)
N$57: IC2.15(QA) IC9.5(1C1) IC38.2(A:A1)
N$66: IC2.14(QB) IC38.4(A:A2)
N$69: IC2.13(QC) IC38.6(A:A3)
N$70: IC2.12(QD) IC38.8(A:A4)
N$71: IC37.15(QA) IC38.11(B:A1)
N$72: IC37.14(QB) IC38.13(B:A2)
N$73: IC37.13(QC) IC38.15(B:A3)
N$74: IC9.4(1C2) IC37.12(QD) IC38.17(B:A4)
N$75: IC2.2(SR) IC40.7(1Y)
N$76: IC37.7(SL) IC40.9(2Y)
SHIFT-OUT: IC7.9(B:Q) ; also sheet 1
SR-LD: IC2.11(CLK) IC7.11(B:CLK) IC37.11(CLK) ; also sheet 2
VCC: IC2.1(CLR) IC7.10(B:PRE) IC7.13(B:CLR) IC37.1(CLR) ; also sheet 1,2,6
Unconnected: IC7.8(B:!Q) IC9.3(1C3) IC9.6(1C0) IC9.9(2Y) IC40.1(1G) IC40.4(1C2) IC40.15(2G)

### Buses
INV-IN[0..7]
ACO-DATA[0..7]

### Notes on the sheet
- overflow and shift

## Sheet 8 of 8: Add/Sub
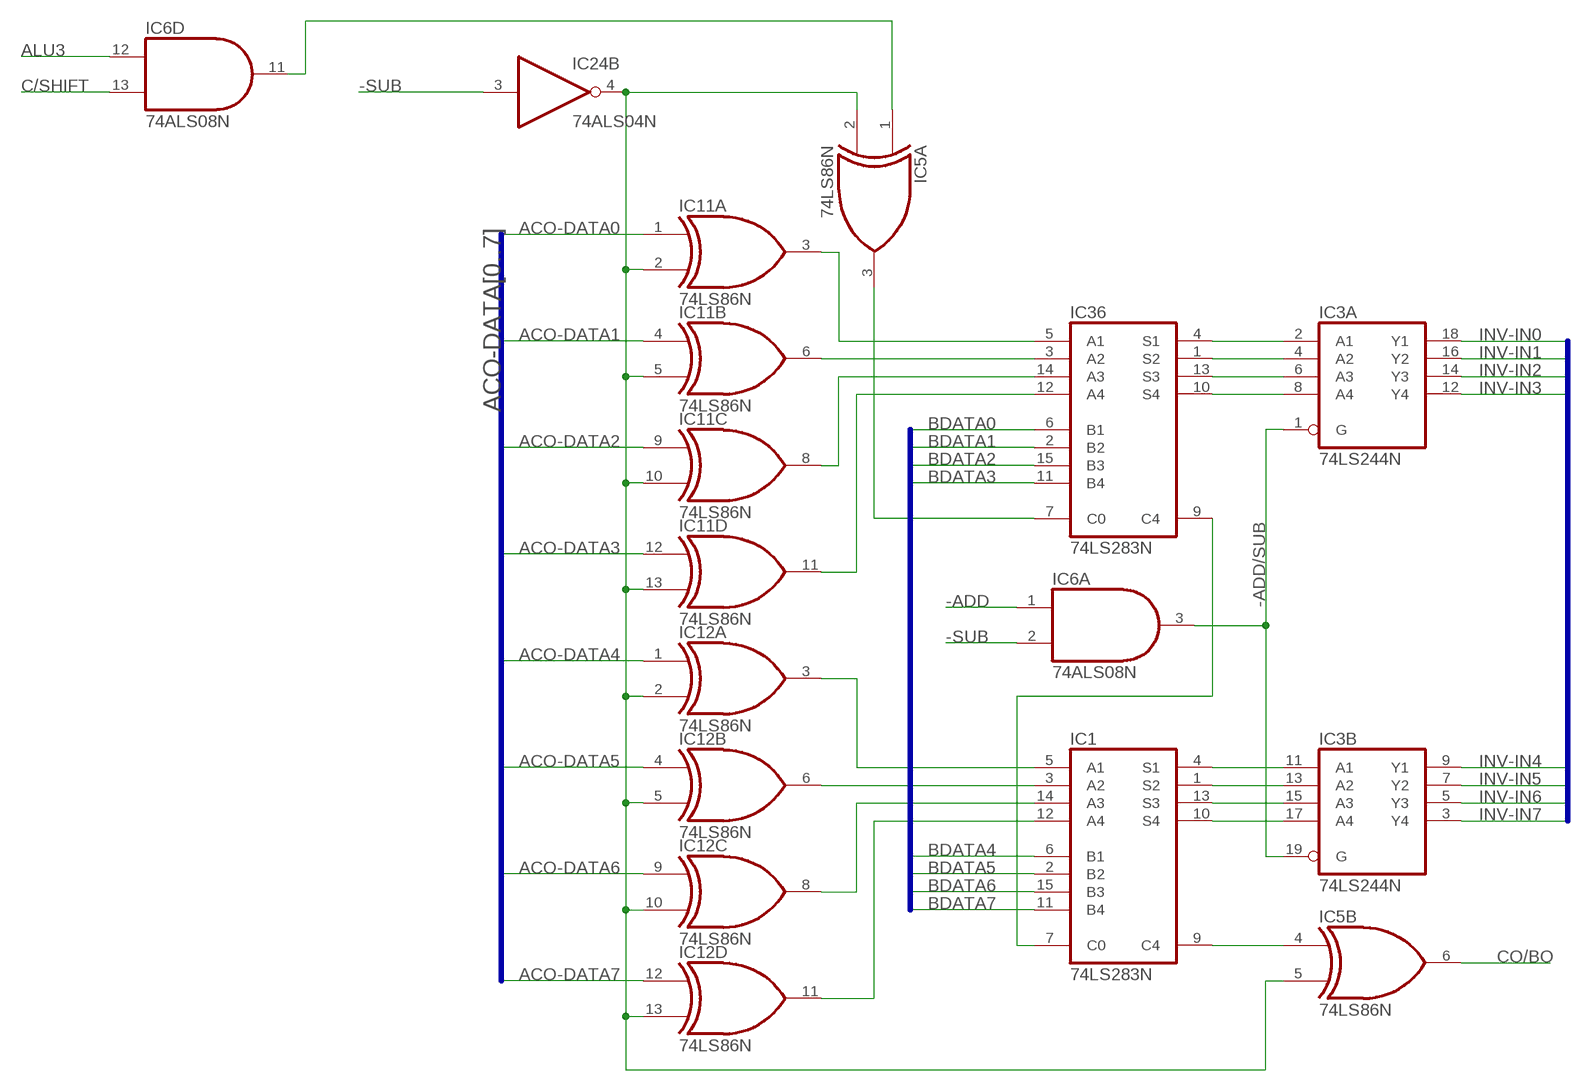
[diagram p7: schematic, sheet 8]

### Parts
IC1  74LS283N  [DIL16]
IC3  74LS244N  [DIL20]
IC11  74LS86N  [DIL14]
IC12  74LS86N  [DIL14]
IC36  74LS283N  [DIL16]

### Nets
-ADD: IC6.1(A:I0) ; also sheet 1
-ADD/SUB: IC3.1(A:G) IC3.19(B:G) IC6.3(A:O) ; also sheet 1
-SUB: IC6.2(A:I1) IC24.3(B:I) ; also sheet 1
ACO-DATA0: IC11.1(A:I0) ; also sheet 1,4,5,6,7
ACO-DATA1: IC11.4(B:I0) ; also sheet 1,4,5,6,7
ACO-DATA2: IC11.9(C:I0) ; also sheet 1,4,5,6,7
ACO-DATA3: IC11.12(D:I0) ; also sheet 1,4,5,6,7
ACO-DATA4: IC12.1(A:I0) ; also sheet 1,4,5,6,7
ACO-DATA5: IC12.4(B:I0) ; also sheet 1,4,5,6,7
ACO-DATA6: IC12.9(C:I0) ; also sheet 1,4,5,6,7
ACO-DATA7: IC12.12(D:I0) ; also sheet 1,4,5,6,7
ALU3: IC6.12(D:I0) ; also sheet 2,7
BDATA0: IC36.6(B1) ; also sheet 2,3,4,5,6
BDATA1: IC36.2(B2) ; also sheet 2,3,4,5,6
BDATA2: IC36.15(B3) ; also sheet 2,3,4,5,6
BDATA3: IC36.11(B4) ; also sheet 2,3,4,5,6
BDATA4: IC1.6(B1) ; also sheet 2,3,4,5,6
BDATA5: IC1.2(B2) ; also sheet 2,3,4,5,6
BDATA6: IC1.15(B3) ; also sheet 2,3,4,5,6
BDATA7: IC1.11(B4) ; also sheet 2,3,4,5,6
C/SHIFT: IC6.13(D:I1) ; also sheet 1,6,7
CO/BO: IC5.6(B:O) ; also sheet 1
INV-IN0: IC3.18(A:Y1) ; also sheet 1,4,5,7
INV-IN1: IC3.16(A:Y2) ; also sheet 1,4,5,7
INV-IN2: IC3.14(A:Y3) ; also sheet 1,4,5,7
INV-IN3: IC3.12(A:Y4) ; also sheet 1,4,5,7
INV-IN4: IC3.9(B:Y1) ; also sheet 1,4,5,7
INV-IN5: IC3.7(B:Y2) ; also sheet 1,4,5,7
INV-IN6: IC3.5(B:Y3) ; also sheet 1,4,5,7
INV-IN7: IC3.3(B:Y4) ; also sheet 1,4,5,7
N$1: IC1.9(C4) IC5.4(B:I0)
N$2: IC5.3(A:O) IC36.7(C0)
N$8: IC5.1(A:I0) IC6.11(D:O)
N$25: IC11.6(B:O) IC36.3(A2)
N$26: IC11.8(C:O) IC36.14(A3)
N$27: IC11.11(D:O) IC36.12(A4)
N$28: IC11.3(A:O) IC36.5(A1)
N$29: IC1.5(A1) IC12.3(A:O)
N$30: IC1.3(A2) IC12.6(B:O)
N$31: IC1.14(A3) IC12.8(C:O)
N$32: IC1.12(A4) IC12.11(D:O)
N$33: IC3.2(A:A1) IC36.4(S1)
N$34: IC3.4(A:A2) IC36.1(S2)
N$35: IC3.6(A:A3) IC36.13(S3)
N$36: IC3.8(A:A4) IC36.10(S4)
N$37: IC1.4(S1) IC3.11(B:A1)
N$38: IC1.1(S2) IC3.13(B:A2)
N$39: IC1.13(S3) IC3.15(B:A3)
N$40: IC1.10(S4) IC3.17(B:A4)
N$41: IC1.7(C0) IC36.9(C4)
SUB: IC5.2(A:I1) IC5.5(B:I1) IC11.2(A:I1) IC11.5(B:I1) IC11.10(C:I1) IC11.13(D:I1) IC12.2(A:I1) IC12.5(B:I1) IC12.10(C:I1) IC12.13(D:I1) IC24.4(B:O)

### Buses
INV-IN[0..7]
ACO-DATA[0..7]
BDATA[0..7]

## Power pins joined to a net without a drawn wire
GND: IC1.8(GND) IC2.8(GND) IC3.10(P:GND) IC4.8(GND) IC5.7(P:GND) IC6.7(P:GND) IC7.7(P:GND) IC8.7(P:GND) IC9.8(GND) IC11.7(P:GND) IC12.7(P:GND) IC14.10(P:GND) IC16.10(P:GND) IC18.10(P:GND) IC19.10(GND) IC20.10(P:GND) IC21.10(P:GND) IC22.8(GND) IC23.8(GND) IC24.7(P:GND) IC25.7(P:GND) IC26.8(GND) IC28.8(GND) IC29.8(GND) IC30.8(GND) IC31.8(GND) IC32.10(P:GND) IC33.10(GND) IC34.10(P:GND) IC35.10(GND) IC36.8(GND) IC37.8(GND) IC38.10(P:GND) IC39.7(P:GND) IC40.8(GND) IC42.7(P:GND) IC43.7(P:GND) IC44.7(P:GND) IC45.10(P:GND) IC46.10(P:GND) IC47.10(P:GND) IC48.7(P:GND) IC49.7(P:GND) IC50.7(P:GND) IC51.7(P:GND)
VCC: IC1.16(VCC) IC2.16(VCC) IC3.20(P:VCC) IC4.16(VCC) IC5.14(P:VCC) IC6.14(P:VCC) IC7.14(P:VCC) IC8.14(P:VCC) IC9.16(VCC) IC11.14(P:VCC) IC12.14(P:VCC) IC14.20(P:VCC) IC16.20(P:VCC) IC18.20(P:VCC) IC19.20(VCC) IC20.20(P:VCC) IC21.20(P:VCC) IC22.16(VCC) IC23.16(VCC) IC24.14(P:VCC) IC25.14(P:VCC) IC26.16(VCC) IC28.16(VCC) IC29.16(VCC) IC30.16(VCC) IC31.16(VCC) IC32.20(P:VCC) IC33.20(VCC) IC34.20(P:VCC) IC35.20(VCC) IC36.16(VCC) IC37.16(VCC) IC38.20(P:VCC) IC39.14(P:VCC) IC40.16(VCC) IC42.14(P:VCC) IC43.14(P:VCC) IC44.14(P:VCC) IC45.20(P:VCC) IC46.20(P:VCC) IC47.20(P:VCC) IC48.14(P:VCC) IC49.14(P:VCC) IC50.14(P:VCC) IC51.14(P:VCC)

## Library data of the parts
C1-C44 = rcl:C-US: CAPACITOR, American symbol
IC1 IC36 = 74xx-us:74*283: 4-bit binary FULL ADDER, fast carry
IC2 IC37 = 74xx-us:74*194: 4-bit bidirectional SHIFT REGISTER
IC3 IC14 IC18 IC20 IC21 IC32 IC34 IC38 IC45-IC47 = 74xx-us:74*244: Octal BUFFER and LINE DRIVER, 3-state
IC4 = 74xx-us:74*138: 3-line to 8-line DECODER/DEMULTIPLEXER
IC5 IC11 IC12 IC44 IC50 = 74xx-us:74*86: Quad 2-input EXCLUSIV-OR (XOR) gate
IC6 IC48 IC49 = 74xx-us:74*08: Quad 2-input AND gate
IC7 = 74xx-us:74*74: Dual D type positive edge triggered FLIP FLOP, preset and clear
IC8 IC24 = 74xx-us:74*04: Hex INVERTER
IC9 IC40 = 74xx-us:74*153: Dual 4-line to 1-line data SELECTOR/MULTIPLEXER
IC16 = 74xx-us:74*240: Octal BUFFER and LINE DRIVER, 3-state
IC19 = 74xx-us:74*374: Octal D type transparent LATCH, edge triggered
IC22 IC23 = 74xx-us:74*85: 4-bit magnitude COMPARATOR
IC25 IC42 IC43 = 74xx-us:74*32: Quad 2-input OR gate
IC26 = 74xx-us:74*251: 1 of 8 data SELECTOR/MULTIPLEXER, 3-state
IC28-IC31 = 74xx-us:74*192: Synchronous 4-bit UP/DOWN COUNTER
IC33 IC35 = 74xx-us:74*245: Octal BUS TRANSCEIVER, 3-state
IC39 IC51 = 74xx-us:74*00: Quad 2-input NAND gate
RN3 RN4 = resistor-net:RNX8: RESISTOR NETWORK; OC_FARNELL: unknown; OC_NEWARK: unknown
V1 V2 = 74ttl-din:74*4078: 8-input OR/NOR, complementary outputs
X1 = con-vg:FABC96R: CONNECTOR female, 96 pins, type R, rows ABC, grid 2.54 mm

## Board
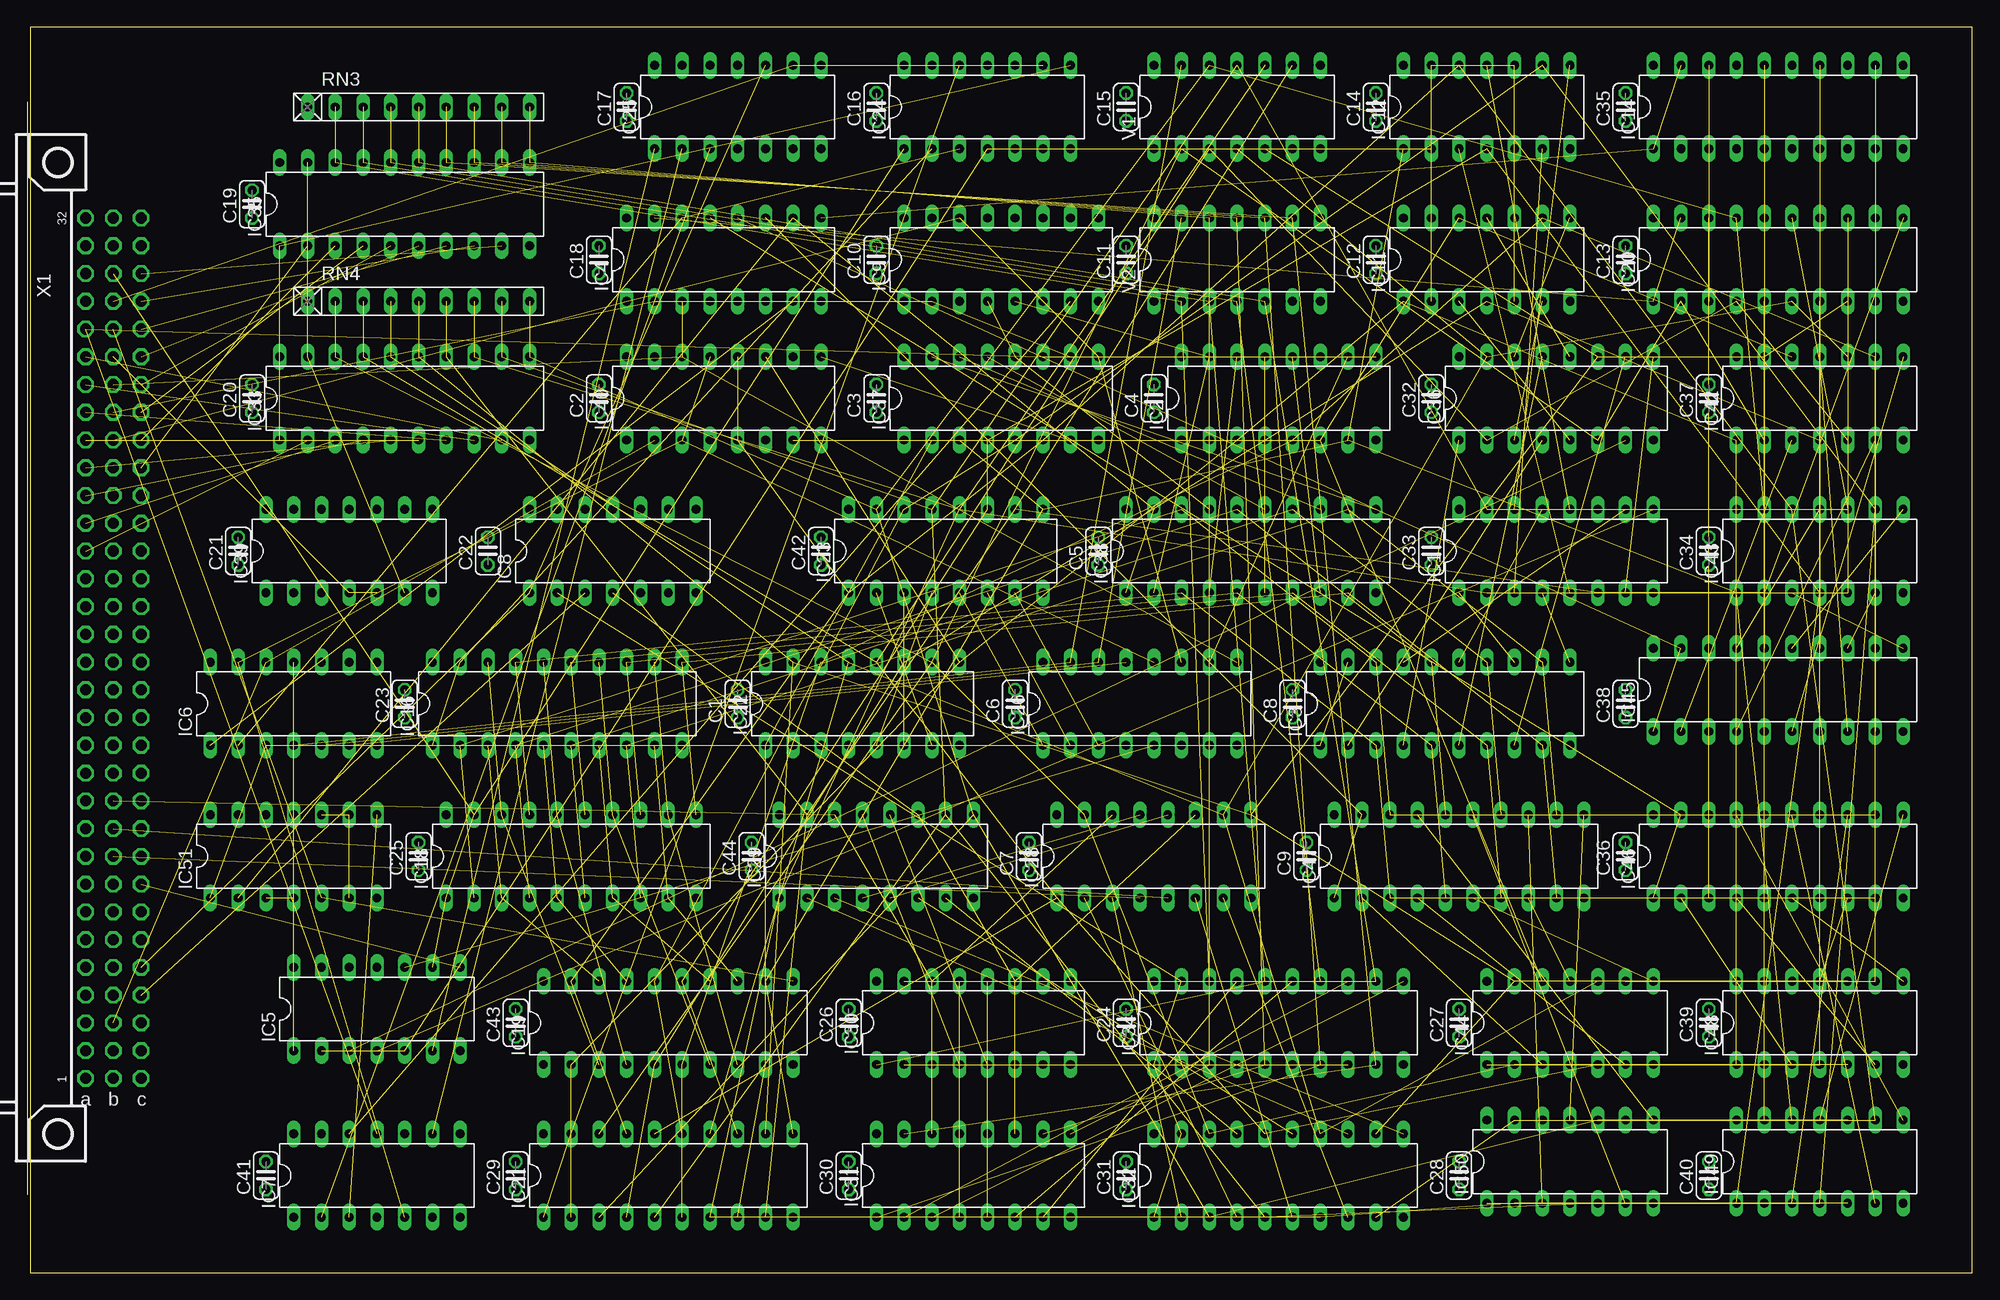
[diagram p8: board, top side]
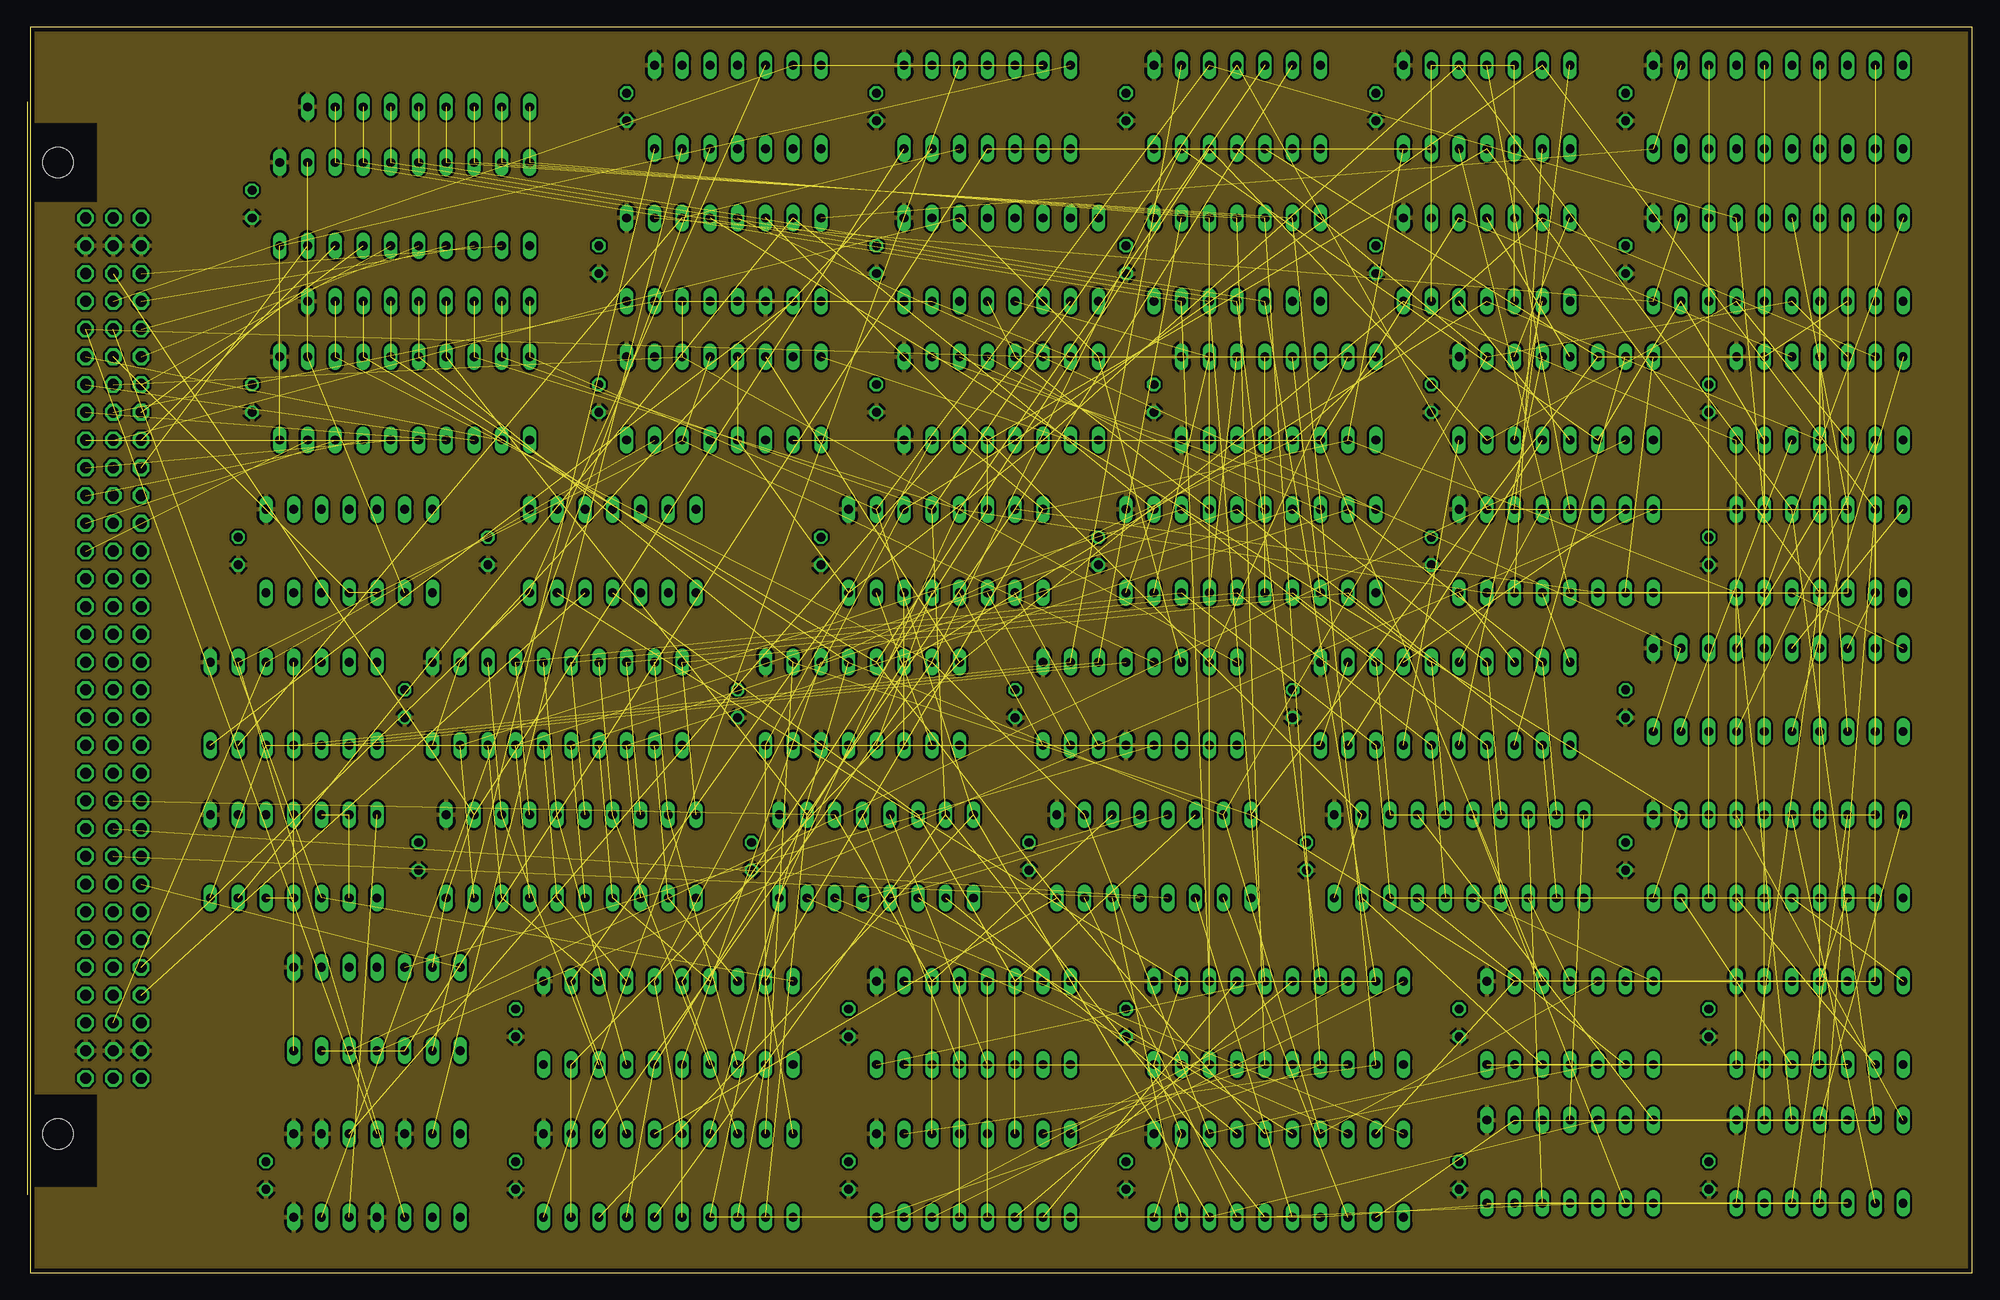
[diagram p9: board, inner layer Route2]
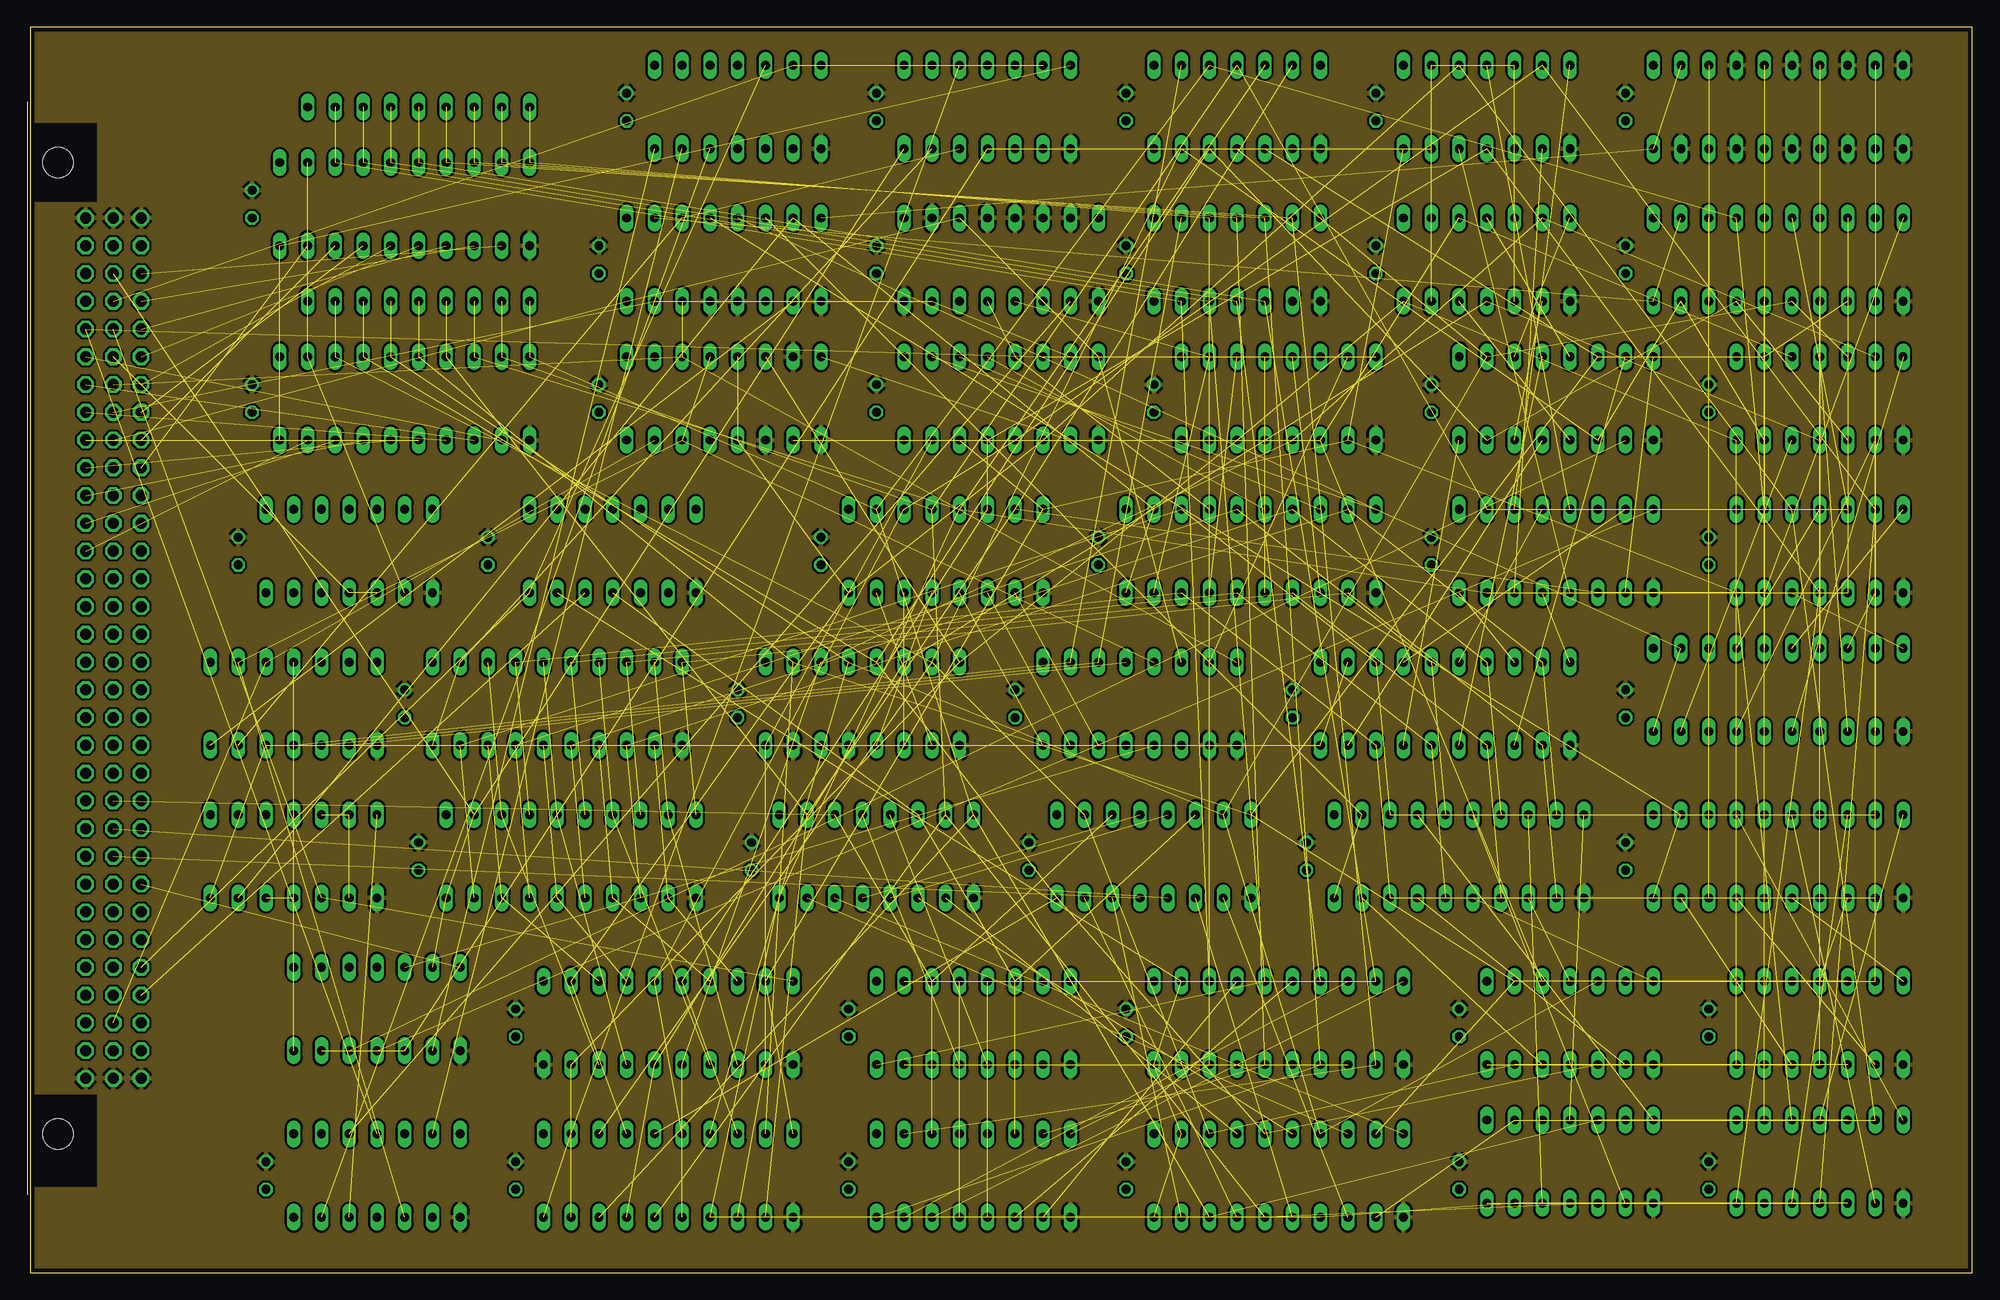
[diagram p10: board, inner layer Route15]

Size 177.78 x 113.97 mm. Coordinates in mm from the lower left corner, seen from the top.
Outline: 0,0 177.78,0 177.78,113.97 0,113.97 0,0
Copper layers (1*2*15*16): Top 0.035559375mm / dielectric 0.17018125mm / Route2 0.01778125mm / dielectric 47mil / Route15 0.01778125mm / dielectric 0.17018125mm / Bottom 0.035559375mm
Design rules "OSHPark-4layer *": minimum track width 8mil, minimum drill 10mil, track to track 8mil, track to pad 8mil, pad to pad 8mil, via to via 8mil, smd to smd 5mil, copper to edge 15mil, drill to drill 8mil, minimum pad ring 4mil, minimum via ring 4mil, stop-mask expansion 2.5mil, vias tented up to drill 0mil, thermal gap 10mil

### Footprints (pad centres in the part's own frame; a part is rotated, then mirrored left to right if it is on the bottom)
C025-024X044 = drill 0.813 octagon: 1 -1.27,0; 2 1.27,0
DIL16 = drill 0.813 long: 1 -8.89,-3.81; 2 -6.35,-3.81; 3 -3.81,-3.81; 4 -1.27,-3.81; 5 1.27,-3.81; 6 3.81,-3.81; 7 6.35,-3.81; 8 8.89,-3.81; 9 8.89,3.81; 10 6.35,3.81; 11 3.81,3.81; 12 1.27,3.81; 13 -1.27,3.81; 14 -3.81,3.81; 15 -6.35,3.81; 16 -8.89,3.81
DIL20 = drill 0.813 long: 1 -11.43,-3.81; 2 -8.89,-3.81; 3 -6.35,-3.81; 4 -3.81,-3.81; 5 -1.27,-3.81; 6 1.27,-3.81; 7 3.81,-3.81; 8 6.35,-3.81; 9 8.89,-3.81; 10 11.43,-3.81; 11 11.43,3.81; 12 8.89,3.81; 13 6.35,3.81; 14 3.81,3.81; 15 1.27,3.81; 16 -1.27,3.81; 17 -3.81,3.81; 18 -6.35,3.81; 19 -8.89,3.81; 20 -11.43,3.81
DIL14 = drill 0.813 long: 1 -7.62,-3.81; 2 -5.08,-3.81; 3 -2.54,-3.81; 4 0,-3.81; 5 2.54,-3.81; 6 5.08,-3.81; 7 7.62,-3.81; 8 7.62,3.81; 9 5.08,3.81; 10 2.54,3.81; 11 0,3.81; 12 -2.54,3.81; 13 -5.08,3.81; 14 -7.62,3.81
RN-9 = drill 0.813 long: 1 -10.16,0; 2 -7.62,0; 3 -5.08,0; 4 -2.54,0; 5 0,0; 6 2.54,0; 7 5.08,0; 8 7.62,0; 9 10.16,0
FABC96R = drill 1.016 octagon: A1 -2.54,39.37; A2 -2.54,36.83; A3 -2.54,34.29; A4 -2.54,31.75; A5 -2.54,29.21; A6 -2.54,26.67; A7 -2.54,24.13; A8 -2.54,21.59; A9 -2.54,19.05; A10 -2.54,16.51; A11 -2.54,13.97; A12 -2.54,11.43; A13 -2.54,8.89; A14 -2.54,6.35; A15 -2.54,3.81; A16 -2.54,1.27; A17 -2.54,-1.27; A18 -2.54,-3.81; A19 -2.54,-6.35; A20 -2.54,-8.89; A21 -2.54,-11.43; A22 -2.54,-13.97; A23 -2.54,-16.51; A24 -2.54,-19.05; A25 -2.54,-21.59; A26 -2.54,-24.13; A27 -2.54,-26.67; A28 -2.54,-29.21; A29 -2.54,-31.75; A30 -2.54,-34.29; A31 -2.54,-36.83; A32 -2.54,-39.37; B1 -5.08,39.37; B2 -5.08,36.83; B3 -5.08,34.29; B4 -5.08,31.75; B5 -5.08,29.21; B6 -5.08,26.67; B7 -5.08,24.13; B8 -5.08,21.59; B9 -5.08,19.05; B10 -5.08,16.51; B11 -5.08,13.97; B12 -5.08,11.43; B13 -5.08,8.89; B14 -5.08,6.35; B15 -5.08,3.81; B16 -5.08,1.27; B17 -5.08,-1.27; B18 -5.08,-3.81; B19 -5.08,-6.35; B20 -5.08,-8.89; B21 -5.08,-11.43; B22 -5.08,-13.97; B23 -5.08,-16.51; B24 -5.08,-19.05; B25 -5.08,-21.59; B26 -5.08,-24.13; B27 -5.08,-26.67; B28 -5.08,-29.21; B29 -5.08,-31.75; B30 -5.08,-34.29; B31 -5.08,-36.83; B32 -5.08,-39.37; C1 -7.62,39.37; C2 -7.62,36.83; C3 -7.62,34.29; C4 -7.62,31.75; C5 -7.62,29.21; C6 -7.62,26.67; C7 -7.62,24.13; C8 -7.62,21.59; C9 -7.62,19.05; C10 -7.62,16.51; C11 -7.62,13.97; C12 -7.62,11.43; C13 -7.62,8.89; C14 -7.62,6.35; C15 -7.62,3.81; C16 -7.62,1.27; C17 -7.62,-1.27; C18 -7.62,-3.81; C19 -7.62,-6.35; C20 -7.62,-8.89; C21 -7.62,-11.43; C22 -7.62,-13.97; C23 -7.62,-16.51; C24 -7.62,-19.05; C25 -7.62,-21.59; C26 -7.62,-24.13; C27 -7.62,-26.67; C28 -7.62,-29.21; C29 -7.62,-31.75; C30 -7.62,-34.29; C31 -7.62,-36.83; C32 -7.62,-39.37 | hole 2.794: 0,-44.456; 0,44.456

### Placement (x,y rotation side)
C1  64.77,52.07 90 top
C2  52.07,80.01 90 top
C3  77.47,80.01 90 top
C4  102.87,80.01 90 top
C5  97.79,66.04 90 top
C6  90.17,52.07 90 top
C7  91.44,38.1 90 top
C8  115.57,52.07 90 top
C9  116.84,38.1 90 top
C10  77.47,92.71 90 top
C11  100.33,92.71 90 top
C12  123.19,92.71 90 top
C13  146.05,92.71 90 top
C14  123.19,106.68 90 top
C15  100.33,106.68 90 top
C16  77.47,106.68 90 top
C17  54.61,106.68 90 top
C18  52.07,92.71 90 top
C19  20.32,97.79 90 top
C20  20.32,80.01 90 top
C21  19.05,66.04 90 top
C22  41.91,66.04 90 top
C23  34.29,52.07 90 top
C24  100.33,22.86 90 top
C25  35.56,38.1 90 top
C26  74.93,22.86 90 top
C27  130.81,22.86 90 top
C28  130.81,8.89 90 top
C29  44.45,8.89 90 top
C30  74.93,8.89 90 top
C31  100.33,8.89 90 top
C32  128.27,80.01 90 top
C33  128.27,66.04 90 top
C34  153.67,66.04 90 top
C35  146.05,106.68 90 top
C36  146.05,38.1 90 top
C37  153.67,80.01 90 top
C38  146.05,52.07 90 top
C39  153.67,22.86 90 top
C40  153.67,8.89 90 top
C41  21.59,8.89 90 top
C42  72.39,66.04 90 top
C43  44.45,22.86 90 top
C44  66.04,38.1 90 top
IC1  139.7,66.04 0 top
IC2  114.3,80.01 0 top
IC3  129.54,52.07 0 top
IC4  63.5,92.71 0 top
IC5  31.75,24.13 0 top
IC6  24.13,52.07 0 top
IC7  31.75,8.89 0 top
IC8  53.34,66.04 0 top
IC9  88.9,92.71 0 top
IC11  133.35,92.71 0 top
IC12  133.35,106.68 0 top
IC14  160.02,106.68 0 top
IC16  48.26,52.07 0 top
IC18  49.53,38.1 0 top
IC19  58.42,22.86 0 top
IC20  160.02,92.71 0 top
IC21  58.42,8.89 0 top
IC22  76.2,52.07 0 top
IC23  83.82,66.04 0 top
IC24  87.63,106.68 0 top
IC25  64.77,106.68 0 top
IC26  101.6,52.07 0 top
IC28  102.87,38.1 0 top
IC29  77.47,38.1 0 top
IC30  86.36,22.86 0 top
IC31  86.36,8.89 0 top
IC32  114.3,8.89 0 top
IC33  34.29,80.01 0 top
IC34  114.3,22.86 0 top
IC35  34.29,97.79 0 top
IC36  139.7,80.01 0 top
IC37  88.9,80.01 0 top
IC38  111.76,66.04 0 top
IC39  29.21,66.04 0 top
IC40  63.5,80.01 0 top
IC42  163.83,80.01 0 top
IC43  163.83,66.04 0 top
IC44  140.97,22.86 0 top
IC45  160.02,53.34 0 top
IC46  160.02,38.1 0 top
IC47  130.81,38.1 0 top
IC48  163.83,22.86 0 top
IC49  163.83,10.16 0 top
IC50  140.97,10.16 0 top
IC51  24.13,38.1 0 top
RN3  35.56,106.68 0 top
RN4  35.56,88.9 0 top
V1  110.49,106.68 0 top
V2  110.49,92.71 0 top
X1  2.54,57.15 180 top

### Tracks (layer width: path | path; a pad name or v marks a point on that pad's centre or on a via)
-ADD  (1 unrouted)
-ADD/SUB  (3 unrouted)
-AND  (2 unrouted)
-BUS-OUT  (2 unrouted)
-DATA  (2 unrouted)
-I/D-REG-LD  (4 unrouted)
-I/D-REG-OUT  (4 unrouted)
-OR  (2 unrouted)
-RD-AC  (2 unrouted)
-SHIFT  (3 unrouted)
-SUB  (2 unrouted)
-XOR  (2 unrouted)
-ZERO  (2 unrouted)
AC-IN-INV  (4 unrouted)
ACI-DATA0  (2 unrouted)
ACI-DATA1  (2 unrouted)
ACI-DATA2  (2 unrouted)
ACI-DATA3  (2 unrouted)
ACI-DATA4  (2 unrouted)
ACI-DATA5  (2 unrouted)
ACI-DATA6  (2 unrouted)
ACI-DATA7  (2 unrouted)
ACO-DATA0  (8 unrouted)
ACO-DATA1  (7 unrouted)
ACO-DATA2  (7 unrouted)
ACO-DATA3  (8 unrouted)
ACO-DATA4  (8 unrouted)
ACO-DATA5  (7 unrouted)
ACO-DATA6  (7 unrouted)
ACO-DATA7  (9 unrouted)
ALU0  (5 unrouted)
ALU1  (5 unrouted)
ALU2  (3 unrouted)
ALU3  (2 unrouted)
ALU-FUNC  (2 unrouted)
BDATA0  (11 unrouted)
BDATA1  (11 unrouted)
BDATA2  (11 unrouted)
BDATA3  (11 unrouted)
BDATA4  (11 unrouted)
BDATA5  (11 unrouted)
BDATA6  (11 unrouted)
BDATA7  (11 unrouted)
BDATA8  (4 unrouted)
BDATA9  (4 unrouted)
BDATA10  (4 unrouted)
BDATA11  (4 unrouted)
BDATA12  (4 unrouted)
BDATA13  (4 unrouted)
BDATA14  (4 unrouted)
BDATA15  (4 unrouted)
BR-COND  (1 unrouted)
C/SHIFT  (4 unrouted)
CO/BO  (1 unrouted)
DATA0  (1 unrouted)
DATA1  (1 unrouted)
DATA2  (1 unrouted)
DATA3  (1 unrouted)
DATA4  (1 unrouted)
DATA5  (1 unrouted)
DATA6  (1 unrouted)
DATA7  (1 unrouted)
DATA8  (1 unrouted)
DATA9  (1 unrouted)
DATA10  (1 unrouted)
DATA11  (1 unrouted)
DATA12  (1 unrouted)
DATA13  (1 unrouted)
DATA14  (1 unrouted)
DATA15  (1 unrouted)
GND
  pour Route15: 0,114.3 177.8,114.3 177.8,113.03 177.8,0 0,0 0,7.62 6.35,7.62 6.35,16.51 1.27,16.51 0,16.51 0,97.79 6.35,97.79 6.35,99.06 6.35,105.41 0,105.41
I/D-REG-DN  (1 unrouted)
I/D-REG-LD  (1 unrouted)
I/D-REG-OUT  (2 unrouted)
I/D-REG-UP  (1 unrouted)
INV-IN0  (8 unrouted)
INV-IN1  (8 unrouted)
INV-IN2  (8 unrouted)
INV-IN3  (8 unrouted)
INV-IN4  (8 unrouted)
INV-IN5  (8 unrouted)
INV-IN6  (8 unrouted)
INV-IN7  (8 unrouted)
LD-AC  (2 unrouted)
N$1  (1 unrouted)
N$2  (1 unrouted)
N$3  (1 unrouted)
N$4  (2 unrouted)
N$5  (1 unrouted)
N$6  (2 unrouted)
N$7  (1 unrouted)
N$8  (1 unrouted)
N$9  (1 unrouted)
N$11  (1 unrouted)
N$25  (1 unrouted)
N$26  (1 unrouted)
N$27  (1 unrouted)
N$28  (1 unrouted)
N$29  (1 unrouted)
N$30  (1 unrouted)
N$31  (1 unrouted)
N$32  (1 unrouted)
N$33  (1 unrouted)
N$34  (1 unrouted)
N$35  (1 unrouted)
N$36  (1 unrouted)
N$37  (1 unrouted)
N$38  (1 unrouted)
N$39  (1 unrouted)
N$40  (1 unrouted)
N$41  (1 unrouted)
N$42  (2 unrouted)
N$43  (1 unrouted)
N$45  (1 unrouted)
N$46  (1 unrouted)
N$47  (1 unrouted)
N$48  (1 unrouted)
N$49  (1 unrouted)
N$52  (2 unrouted)
N$55  (1 unrouted)
N$56  (1 unrouted)
N$57  (2 unrouted)
N$58  (1 unrouted)
N$59  (1 unrouted)
N$60  (1 unrouted)
N$61  (1 unrouted)
N$62  (1 unrouted)
N$63  (1 unrouted)
N$64  (2 unrouted)
N$66  (1 unrouted)
N$69  (1 unrouted)
N$70  (1 unrouted)
N$71  (1 unrouted)
N$72  (1 unrouted)
N$73  (1 unrouted)
N$74  (2 unrouted)
N$75  (1 unrouted)
N$76  (1 unrouted)
N$77  (1 unrouted)
N$78  (1 unrouted)
N$79  (1 unrouted)
N$81  (1 unrouted)
N$82  (1 unrouted)
N$83  (1 unrouted)
N$84  (1 unrouted)
N$85  (1 unrouted)
N$86  (1 unrouted)
N$87  (1 unrouted)
N$88  (1 unrouted)
N$89  (1 unrouted)
N$90  (1 unrouted)
N$91  (1 unrouted)
N$92  (1 unrouted)
N$93  (1 unrouted)
N$94  (1 unrouted)
N$95  (1 unrouted)
N$96  (1 unrouted)
N$97  (1 unrouted)
N$98  (1 unrouted)
N$99  (1 unrouted)
N$100  (1 unrouted)
N$101  (1 unrouted)
R1D0  (1 unrouted)
R1D1  (1 unrouted)
R1D2  (1 unrouted)
R1D3  (1 unrouted)
R1D4  (1 unrouted)
R1D5  (1 unrouted)
R1D6  (1 unrouted)
R1D7  (1 unrouted)
R1D8  (1 unrouted)
R1D9  (1 unrouted)
R1D10  (1 unrouted)
R1D11  (1 unrouted)
R1D12  (1 unrouted)
R1D13A  (1 unrouted)
R1D14  (1 unrouted)
R1D15  (1 unrouted)
RD-AC  (2 unrouted)
RESET  (4 unrouted)
SHIFT-OUT  (1 unrouted)
SR-LD  (3 unrouted)
SUB  (10 unrouted)
VCC
  pour Route2: 0,114.3 177.8,114.3 177.8,0 0,0 0,7.62 6.35,7.62 6.35,16.51 0,16.51 0,97.79 6.35,97.79 6.35,105.41 0,105.41